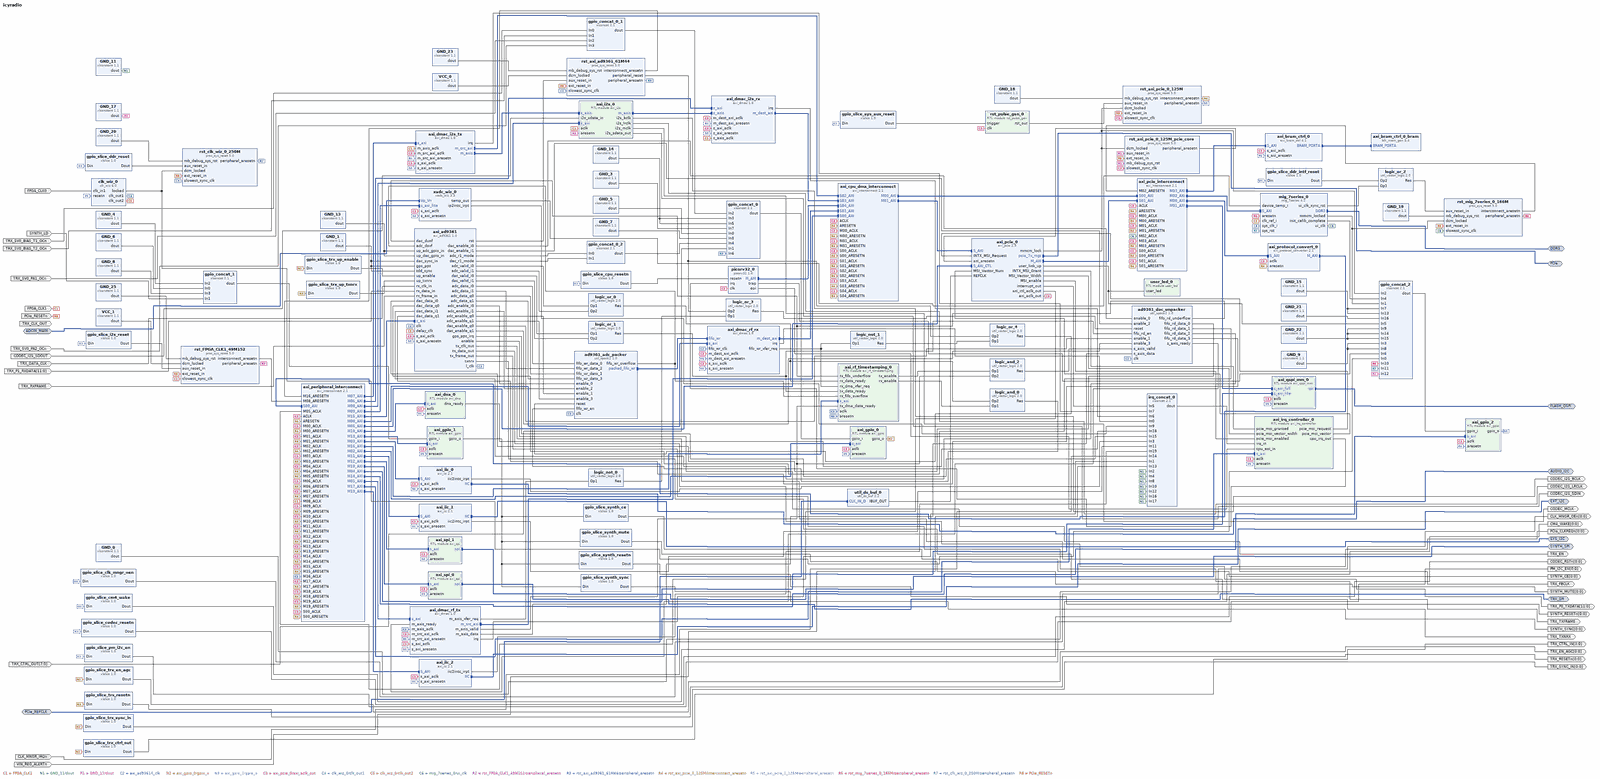
[diagram p0: block diagram of the top level, whole]
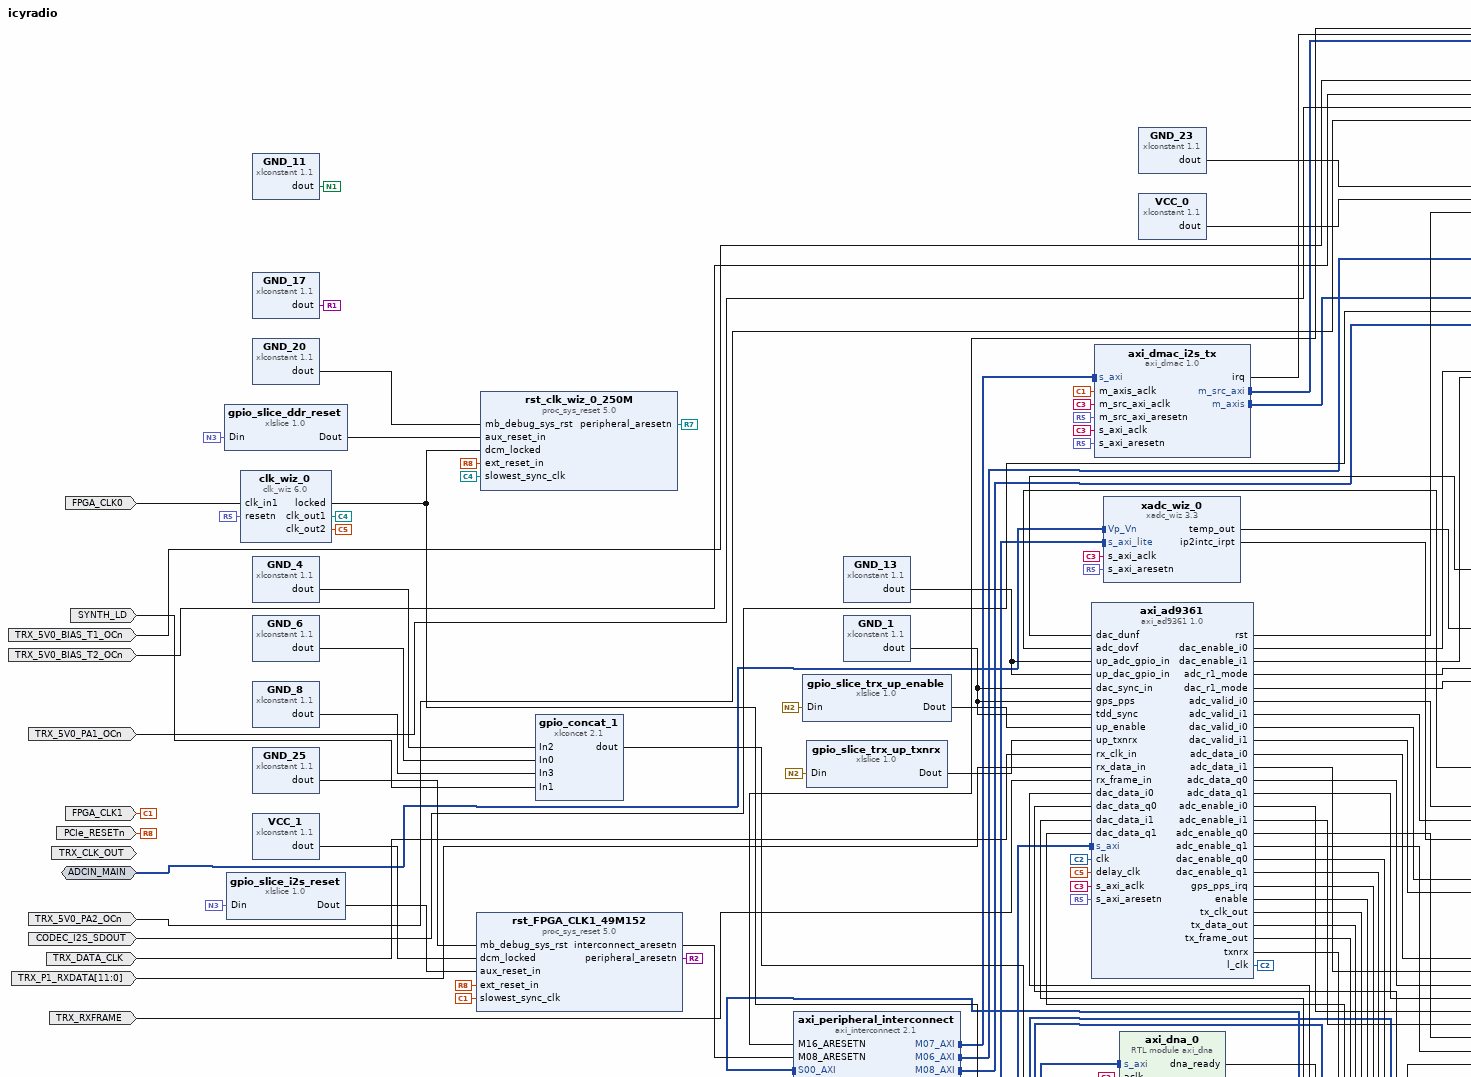
[diagram p1: block diagram of the top level, upper left part]
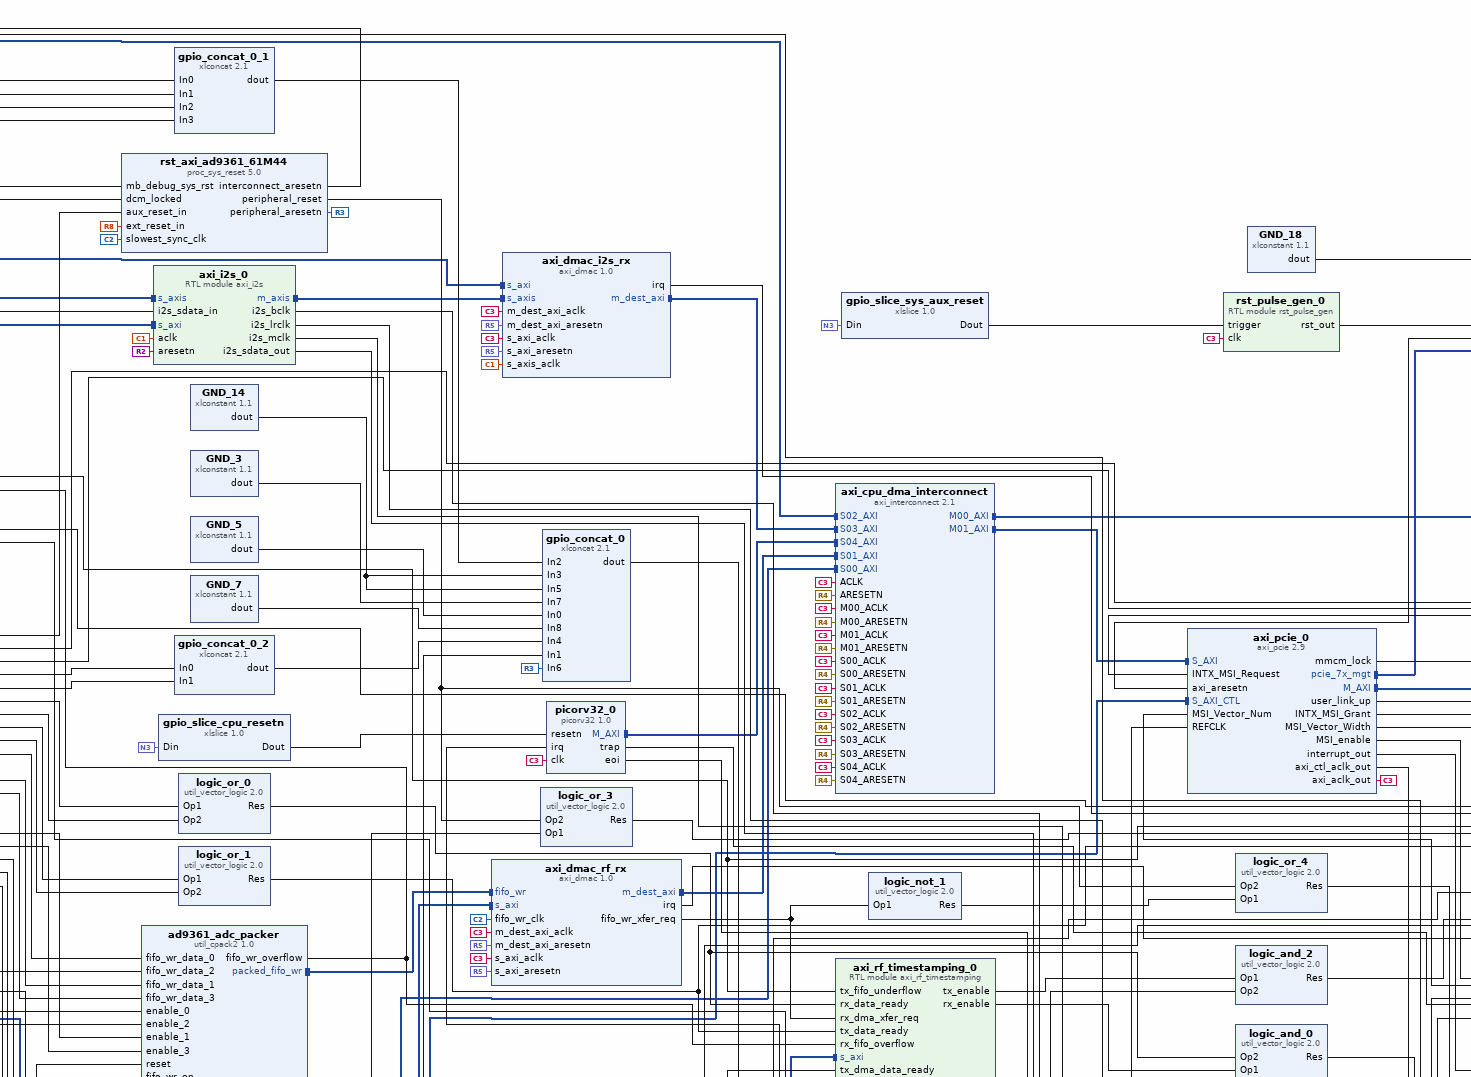
[diagram p2: block diagram of the top level, upper centre part]
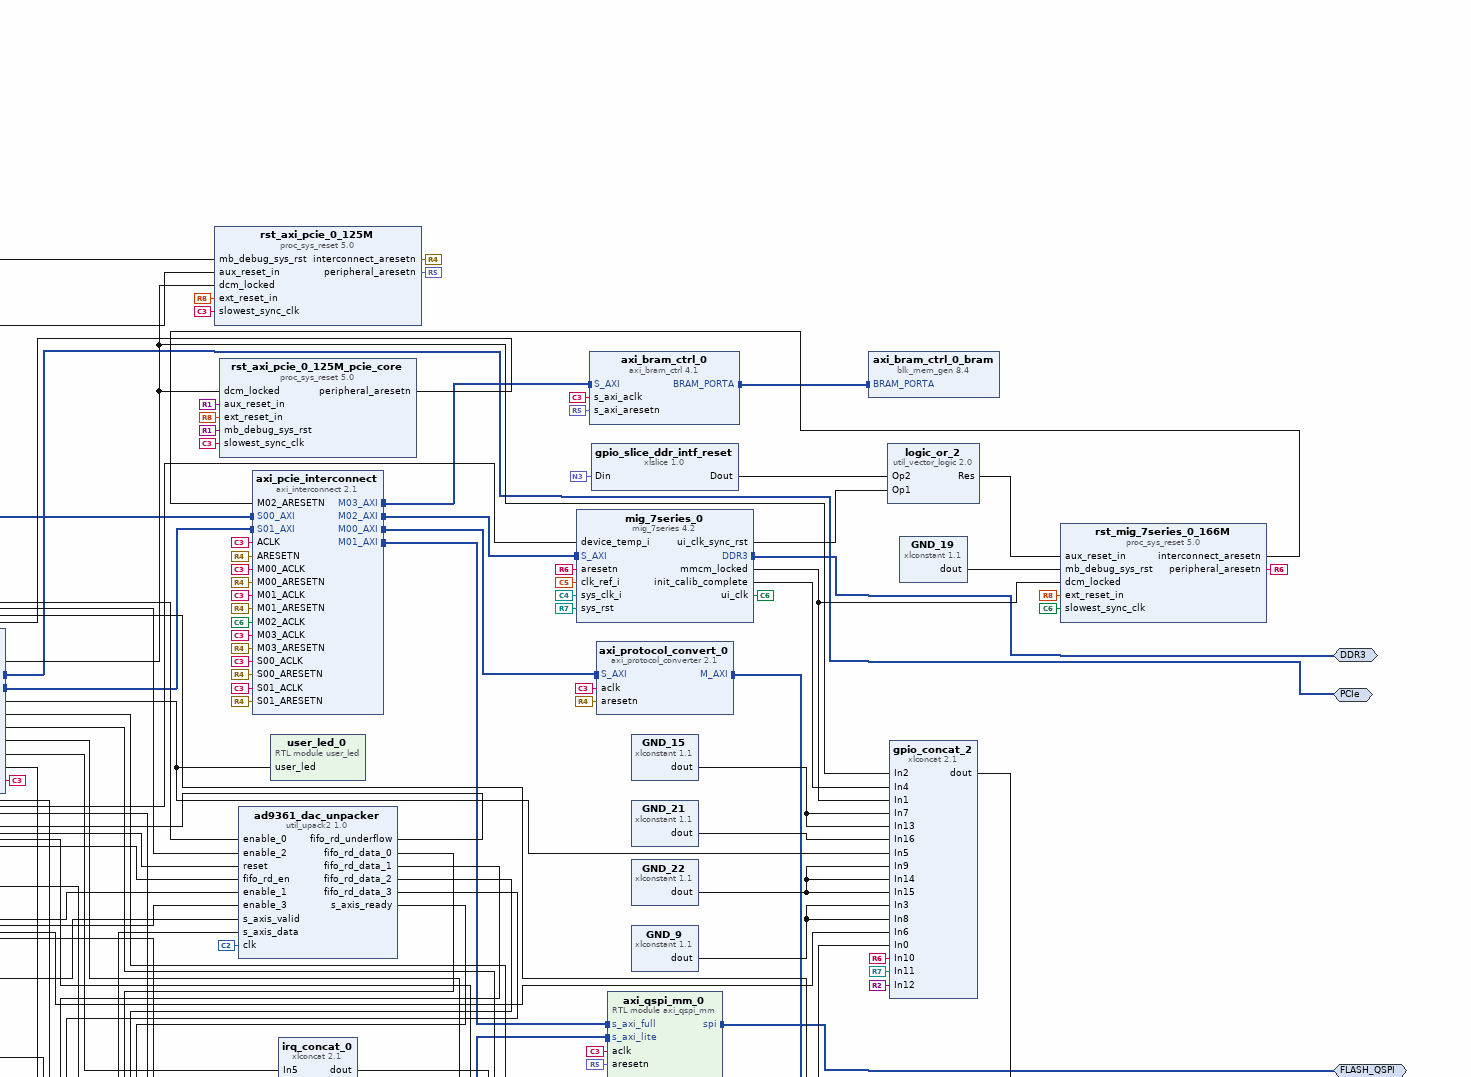
[diagram p3: block diagram of the top level, upper right part]
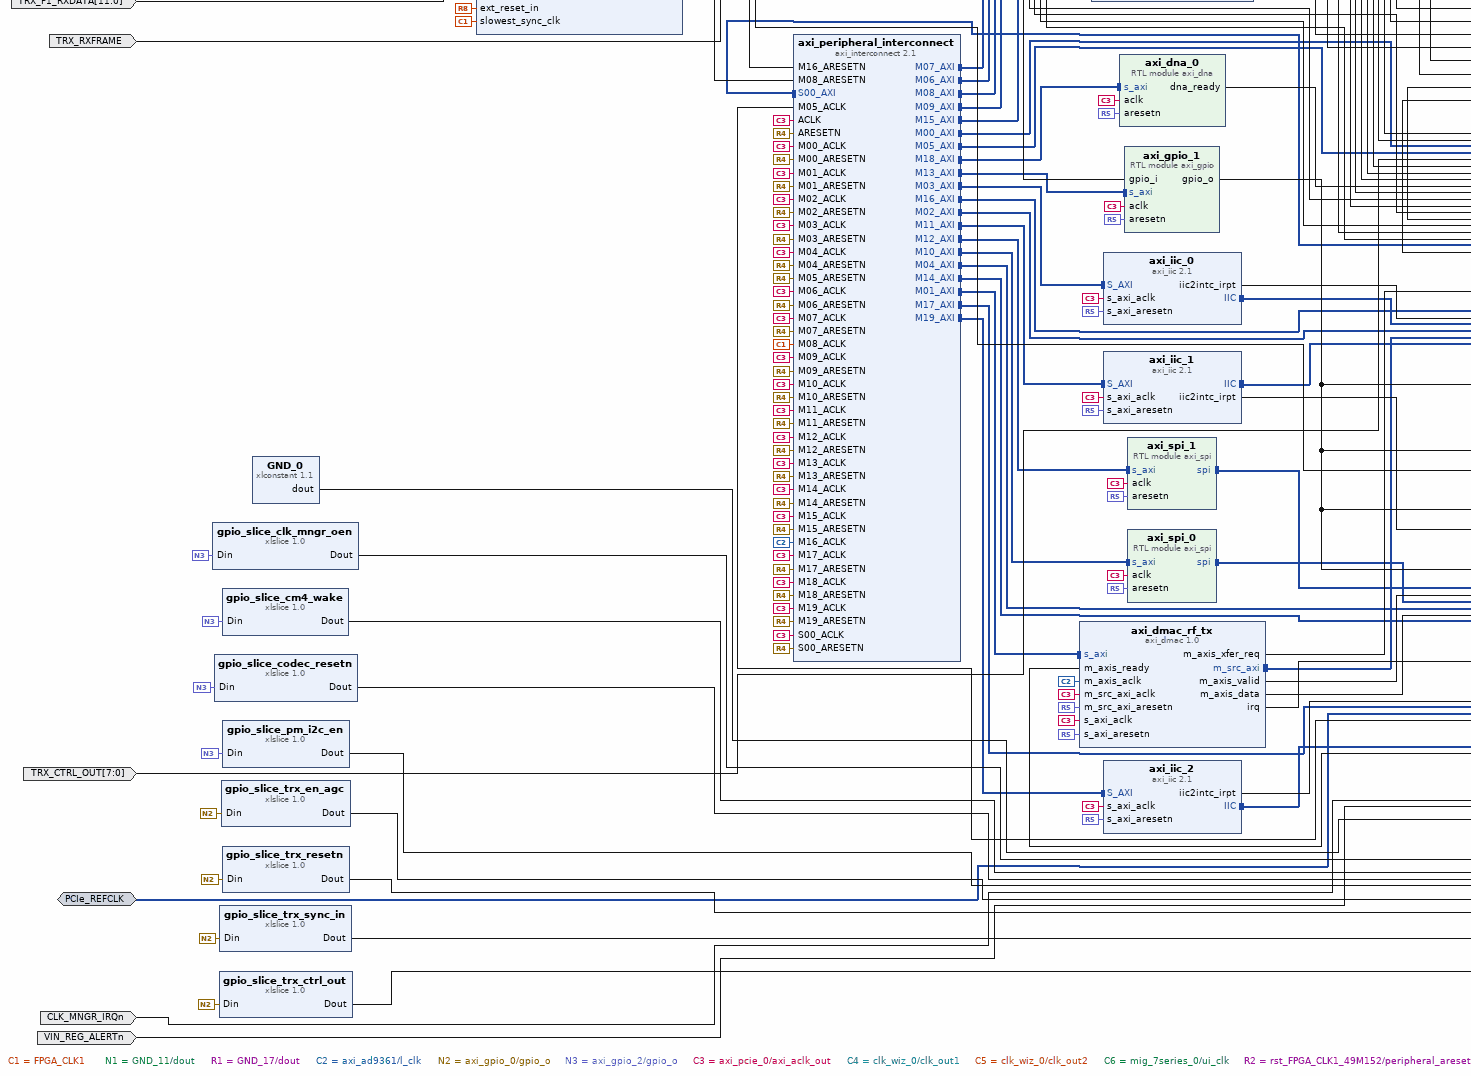
[diagram p4: block diagram of the top level, lower left part]
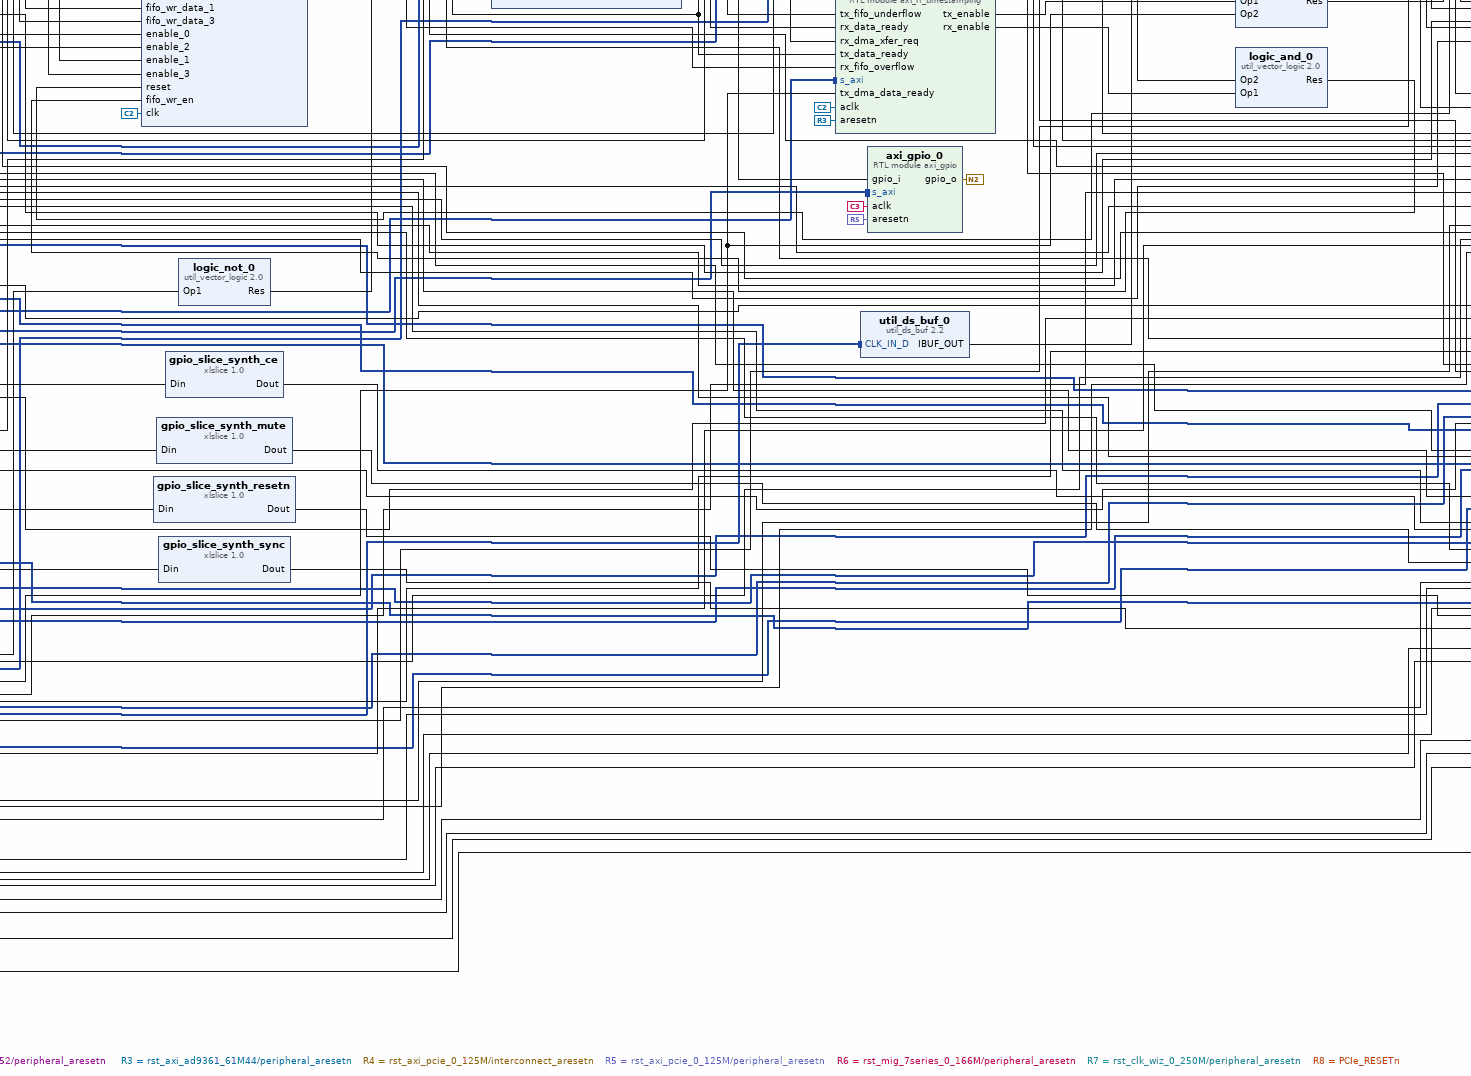
[diagram p5: block diagram of the top level, lower centre part]
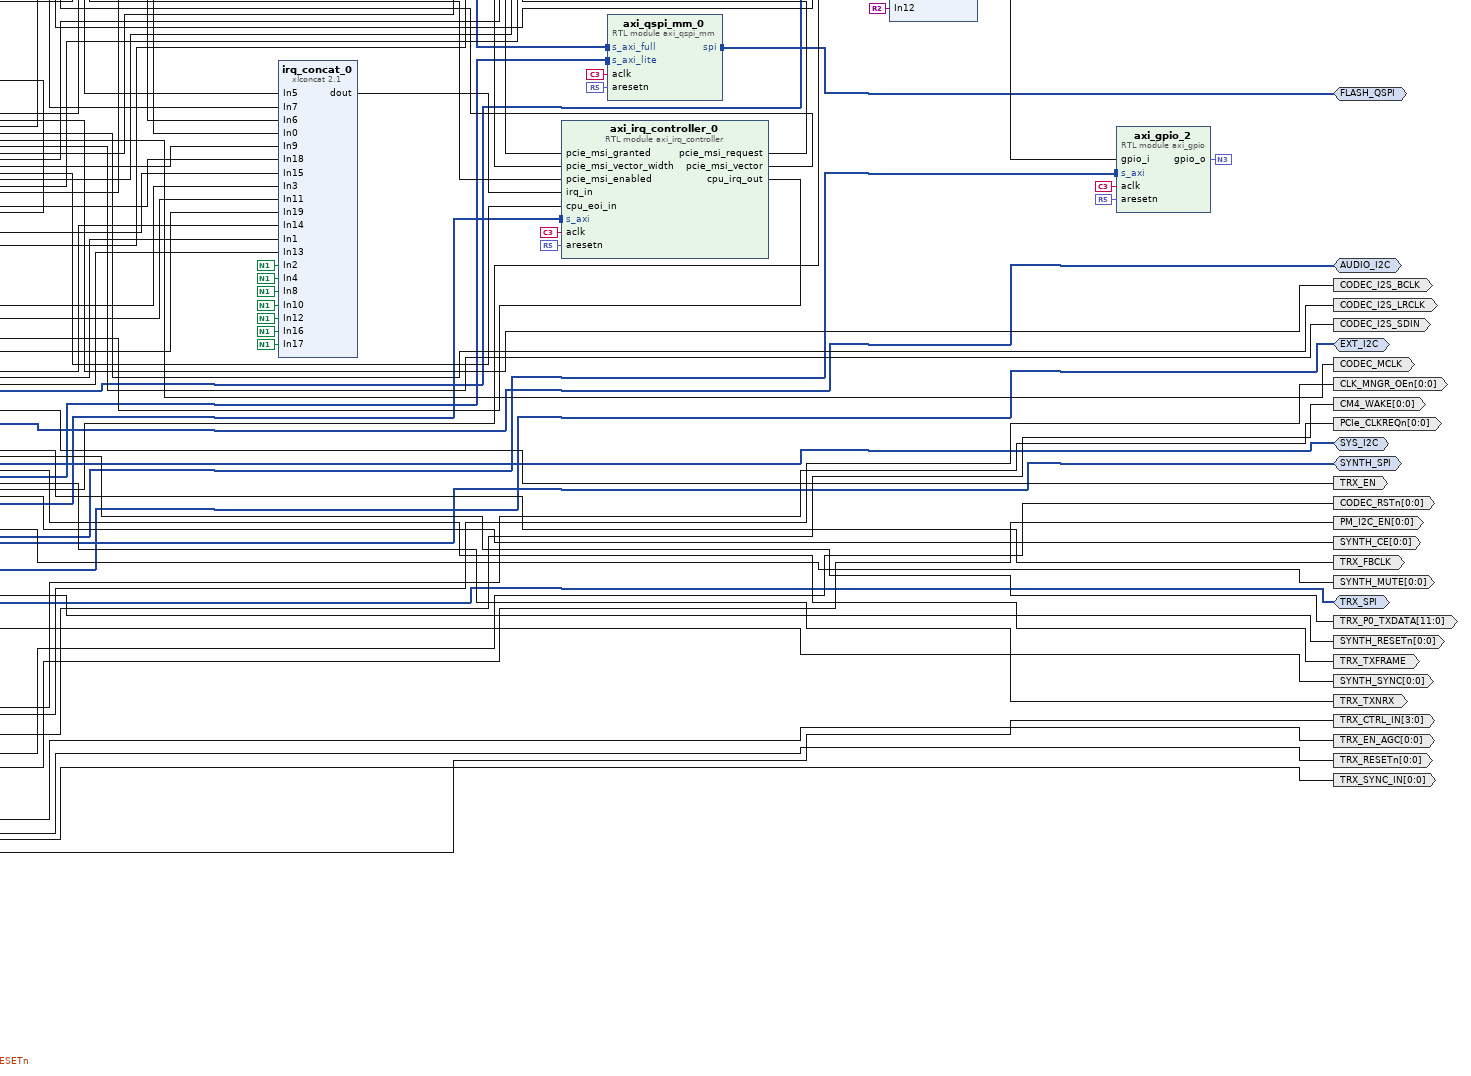
[diagram p6: block diagram of the top level, lower right part]
# Vivado block design icyradio, xc7a100tfgg484-2, Vivado 2021.1
create_bd_design icyradio

create_bd_intf_port -mode Slave -vlnv xilinx.com:interface:diff_clock_rtl:1.0 PCIe_REFCLK
create_bd_intf_port -mode Master -vlnv xilinx.com:interface:pcie_7x_mgt_rtl:1.0 PCIe
create_bd_intf_port -mode Master -vlnv xilinx.com:interface:iic_rtl:1.0 AUDIO_I2C
create_bd_intf_port -mode Master -vlnv xilinx.com:interface:spi_rtl:1.0 FLASH_QSPI
create_bd_intf_port -mode Master -vlnv xilinx.com:interface:ddrx_rtl:1.0 DDR3
create_bd_intf_port -mode Slave -vlnv xilinx.com:interface:diff_analog_io_rtl:1.0 ADCIN_MAIN
create_bd_intf_port -mode Master -vlnv xilinx.com:interface:spi_rtl:1.0 TRX_SPI
create_bd_intf_port -mode Master -vlnv xilinx.com:interface:iic_rtl:1.0 SYS_I2C
create_bd_intf_port -mode Master -vlnv xilinx.com:interface:iic_rtl:1.0 EXT_I2C
create_bd_intf_port -mode Master -vlnv xilinx.com:interface:spi_rtl:1.0 SYNTH_SPI
create_bd_port -dir I -from 11 -to 0 -type data TRX_P1_RXDATA
create_bd_port -dir O -from 11 -to 0 -type data TRX_P0_TXDATA
create_bd_port -dir I -type clk TRX_DATA_CLK
set_property -dict {CONFIG.FREQ_HZ 61440000} [get_bd_ports TRX_DATA_CLK]
create_bd_port -dir O -type clk TRX_FBCLK
create_bd_port -dir O TRX_TXFRAME
create_bd_port -dir I TRX_RXFRAME
create_bd_port -dir O TRX_EN
create_bd_port -dir O TRX_TXNRX
create_bd_port -dir I -type rst PCIe_RESETn
create_bd_port -dir I -type clk FPGA_CLK1
set_property -dict {CONFIG.FREQ_HZ 49152000 CONFIG.PHASE 0.0} [get_bd_ports FPGA_CLK1]
create_bd_port -dir I -type clk TRX_CLK_OUT
set_property -dict {CONFIG.FREQ_HZ 100000000} [get_bd_ports TRX_CLK_OUT]
create_bd_port -dir I -from 7 -to 0 TRX_CTRL_OUT
create_bd_port -dir O -from 3 -to 0 TRX_CTRL_IN
create_bd_port -dir O -from 0 -to 0 TRX_EN_AGC
create_bd_port -dir O -from 0 -to 0 -type rst CODEC_RSTn
create_bd_port -dir O -from 0 -to 0 PCIe_CLKREQn
create_bd_port -dir O -from 0 -to 0 -type rst TRX_RESETn
create_bd_port -dir O -from 0 -to 0 TRX_SYNC_IN
create_bd_port -dir O -from 0 -to 0 SYNTH_RESETn
create_bd_port -dir I TRX_5V0_PA1_OCn
create_bd_port -dir I TRX_5V0_PA2_OCn
create_bd_port -dir I TRX_5V0_BIAS_T1_OCn
create_bd_port -dir I TRX_5V0_BIAS_T2_OCn
create_bd_port -dir I SYNTH_LD
create_bd_port -dir O -from 0 -to 0 SYNTH_MUTE
create_bd_port -dir O -from 0 -to 0 SYNTH_SYNC
create_bd_port -dir O -from 0 -to 0 SYNTH_CE
create_bd_port -dir O -from 0 -to 0 CLK_MNGR_OEn
create_bd_port -dir O -from 0 -to 0 PM_I2C_EN
create_bd_port -dir I CLK_MNGR_IRQn
create_bd_port -dir O -from 0 -to 0 CM4_WAKE
create_bd_port -dir I VIN_REG_ALERTn
create_bd_port -dir O CODEC_I2S_BCLK
create_bd_port -dir O CODEC_I2S_LRCLK
create_bd_port -dir O CODEC_I2S_SDIN
create_bd_port -dir I CODEC_I2S_SDOUT
create_bd_port -dir O CODEC_MCLK
create_bd_port -dir I -type clk FPGA_CLK0
set_property -dict {CONFIG.FREQ_HZ 50000000} [get_bd_ports FPGA_CLK0]

create_bd_cell -type ip -vlnv xilinx.com:ip:blk_mem_gen:8.4 axi_bram_ctrl_0_bram
set_property -dict [list \
  CONFIG.EN_SAFETY_CKT true \
  CONFIG.Enable_32bit_Address true \
  CONFIG.Register_PortA_Output_of_Memory_Primitives false \
  CONFIG.Use_RSTA_Pin true \
  CONFIG.use_bram_block BRAM_Controller \
] [get_bd_cells axi_bram_ctrl_0_bram]
create_bd_cell -type ip -vlnv xilinx.com:ip:util_vector_logic:2.0 logic_and_0
set_property -dict {CONFIG.C_OPERATION and CONFIG.C_SIZE 1} [get_bd_cells logic_and_0]
create_bd_cell -type ip -vlnv xilinx.com:ip:mig_7series:4.2 mig_7series_0
set_property -dict [list \
  CONFIG.BOARD_MIG_PARAM Custom \
  CONFIG.RESET_BOARD_INTERFACE Custom \
  CONFIG.XML_INPUT_FILE mig_a.prj \
] [get_bd_cells mig_7series_0]
create_bd_cell -type ip -vlnv xilinx.com:ip:proc_sys_reset:5.0 rst_mig_7series_0_166M
set_property -dict {CONFIG.C_AUX_RESET_HIGH 1 CONFIG.C_AUX_RST_WIDTH 4} [get_bd_cells rst_mig_7series_0_166M]
create_bd_cell -type ip -vlnv xilinx.com:ip:proc_sys_reset:5.0 rst_axi_pcie_0_125M
set_property -dict {CONFIG.C_AUX_RESET_HIGH 1 CONFIG.C_AUX_RST_WIDTH 4} [get_bd_cells rst_axi_pcie_0_125M]
create_bd_cell -type ip -vlnv analog.com:user:util_upack2:1.0 ad9361_dac_unpacker
create_bd_cell -type ip -vlnv xilinx.com:ip:util_vector_logic:2.0 logic_or_1
set_property -dict {CONFIG.C_OPERATION or CONFIG.C_SIZE 1} [get_bd_cells logic_or_1]
create_bd_cell -type ip -vlnv xilinx.com:ip:util_vector_logic:2.0 logic_or_0
set_property -dict {CONFIG.C_OPERATION or CONFIG.C_SIZE 1} [get_bd_cells logic_or_0]
create_bd_cell -type ip -vlnv xilinx.com:ip:xadc_wiz:3.3 xadc_wiz_0
set_property -dict [list \
  CONFIG.ADC_CONVERSION_RATE 1000 \
  CONFIG.ADC_OFFSET_AND_GAIN_CALIBRATION true \
  CONFIG.AVERAGE_ENABLE_TEMPERATURE true \
  CONFIG.AVERAGE_ENABLE_VBRAM true \
  CONFIG.AVERAGE_ENABLE_VCCAUX true \
  CONFIG.AVERAGE_ENABLE_VCCINT true \
  CONFIG.AVERAGE_ENABLE_VP_VN false \
  CONFIG.CHANNEL_AVERAGING 16 \
  CONFIG.CHANNEL_ENABLE_CALIBRATION false \
  CONFIG.CHANNEL_ENABLE_TEMPERATURE true \
  CONFIG.CHANNEL_ENABLE_VAUXP0_VAUXN0 false \
  CONFIG.CHANNEL_ENABLE_VAUXP10_VAUXN10 false \
  CONFIG.CHANNEL_ENABLE_VAUXP11_VAUXN11 false \
  CONFIG.CHANNEL_ENABLE_VAUXP12_VAUXN12 false \
  CONFIG.CHANNEL_ENABLE_VAUXP13_VAUXN13 false \
  CONFIG.CHANNEL_ENABLE_VAUXP14_VAUXN14 false \
  CONFIG.CHANNEL_ENABLE_VAUXP15_VAUXN15 false \
  CONFIG.CHANNEL_ENABLE_VAUXP1_VAUXN1 false \
  CONFIG.CHANNEL_ENABLE_VAUXP2_VAUXN2 false \
  CONFIG.CHANNEL_ENABLE_VAUXP3_VAUXN3 false \
  CONFIG.CHANNEL_ENABLE_VAUXP4_VAUXN4 false \
  CONFIG.CHANNEL_ENABLE_VAUXP5_VAUXN5 false \
  CONFIG.CHANNEL_ENABLE_VAUXP6_VAUXN6 false \
  CONFIG.CHANNEL_ENABLE_VAUXP7_VAUXN7 false \
  CONFIG.CHANNEL_ENABLE_VAUXP8_VAUXN8 false \
  CONFIG.CHANNEL_ENABLE_VAUXP9_VAUXN9 false \
  CONFIG.CHANNEL_ENABLE_VBRAM true \
  CONFIG.CHANNEL_ENABLE_VCCAUX true \
  CONFIG.CHANNEL_ENABLE_VCCINT true \
  CONFIG.CHANNEL_ENABLE_VP_VN false \
  CONFIG.CHANNEL_ENABLE_VREFN false \
  CONFIG.CHANNEL_ENABLE_VREFP false \
  CONFIG.DCLK_FREQUENCY 125 \
  CONFIG.ENABLE_EXTERNAL_MUX false \
  CONFIG.ENABLE_RESET false \
  CONFIG.ENABLE_TEMP_BUS true \
  CONFIG.ENABLE_VBRAM_ALARM false \
  CONFIG.EXTERNAL_MUX_CHANNEL VP_VN \
  CONFIG.INTERFACE_SELECTION Enable_AXI \
  CONFIG.OT_ALARM false \
  CONFIG.SENSOR_OFFSET_AND_GAIN_CALIBRATION true \
  CONFIG.SEQUENCER_MODE Continuous \
  CONFIG.SINGLE_CHANNEL_SELECTION TEMPERATURE \
  CONFIG.TEMPERATURE_ALARM_OT_RESET 100.0 \
  CONFIG.USER_TEMP_ALARM false \
  CONFIG.VCCAUX_ALARM false \
  CONFIG.VCCINT_ALARM false \
  CONFIG.XADC_STARUP_SELECTION channel_sequencer \
] [get_bd_cells xadc_wiz_0]
create_bd_cell -type ip -vlnv xilinx.com:ip:xlconcat:2.1 irq_concat_0
set_property -dict {CONFIG.NUM_PORTS 20 CONFIG.dout_width 20} [get_bd_cells irq_concat_0]
create_bd_cell -type ip -vlnv xilinx.com:ip:xlconstant:1.1 GND_0
set_property -dict {CONFIG.CONST_VAL 0} [get_bd_cells GND_0]
create_bd_cell -type ip -vlnv analog.com:user:axi_ad9361:1.0 axi_ad9361
set_property -dict [list \
  CONFIG.ADC_USERPORTS_DISABLE 1 \
  CONFIG.CMOS_OR_LVDS_N 1 \
  CONFIG.DAC_IODELAY_ENABLE 0 \
  CONFIG.DAC_USERPORTS_DISABLE 1 \
  CONFIG.DELAY_REFCLK_FREQUENCY 200 \
  CONFIG.DEV_PACKAGE 10 \
  CONFIG.FPGA_FAMILY 1 \
  CONFIG.FPGA_TECHNOLOGY 1 \
  CONFIG.SPEED_GRADE 20 \
  CONFIG.TDD_DISABLE 1 \
] [get_bd_cells axi_ad9361]
create_bd_cell -type ip -vlnv xilinx.com:ip:axi_bram_ctrl:4.1 axi_bram_ctrl_0
set_property -dict [list \
  CONFIG.DATA_WIDTH 64 \
  CONFIG.PROTOCOL AXI4 \
  CONFIG.SINGLE_PORT_BRAM 1 \
  CONFIG.USE_ECC 0 \
] [get_bd_cells axi_bram_ctrl_0]
create_bd_cell -type ip -vlnv xilinx.com:ip:axi_iic:2.1 axi_iic_0
create_bd_cell -type ip -vlnv xilinx.com:ip:axi_pcie:2.9 axi_pcie_0
set_property -dict [list \
  CONFIG.AXIBAR2PCIEBAR_0 0x00000000 \
  CONFIG.AXIBAR2PCIEBAR_1 0x00000000 \
  CONFIG.AXIBAR2PCIEBAR_2 0x00000000 \
  CONFIG.AXIBAR_AS_0 true \
  CONFIG.AXIBAR_AS_1 true \
  CONFIG.AXIBAR_AS_2 true \
  CONFIG.AXIBAR_NUM 3 \
  CONFIG.BAR0_SCALE Megabytes \
  CONFIG.BAR0_SIZE 2 \
  CONFIG.BAR1_ENABLED true \
  CONFIG.BAR1_SCALE Megabytes \
  CONFIG.BAR1_SIZE 512 \
  CONFIG.BAR1_TYPE Memory \
  CONFIG.BAR2_ENABLED true \
  CONFIG.BAR2_SCALE Megabytes \
  CONFIG.BAR2_SIZE 32 \
  CONFIG.BAR2_TYPE Memory \
  CONFIG.BAR_64BIT false \
  CONFIG.BASE_CLASS_MENU Wireless_controller \
  CONFIG.CLASS_CODE 0x0D1000 \
  CONFIG.DEVICE_ID 0x7021 \
  CONFIG.MAX_LINK_SPEED 5.0_GT/s \
  CONFIG.M_AXI_DATA_WIDTH 64 \
  CONFIG.NO_OF_LANES X1 \
  CONFIG.NUM_MSI_REQ 5 \
  CONFIG.PCIEBAR2AXIBAR_0 0x40000000 \
  CONFIG.PCIEBAR2AXIBAR_1 0x20000000 \
  CONFIG.PCIEBAR2AXIBAR_2 0x00000000 \
  CONFIG.SUB_CLASS_INTERFACE_MENU RF_controller \
  CONFIG.S_AXI_DATA_WIDTH 64 \
  CONFIG.S_AXI_SUPPORTS_NARROW_BURST true \
] [get_bd_cells axi_pcie_0]
create_bd_cell -type ip -vlnv xilinx.com:ip:axi_protocol_converter:2.1 axi_protocol_convert_0
set_property -dict {CONFIG.MI_PROTOCOL AXI4LITE CONFIG.SI_PROTOCOL AXI4} [get_bd_cells axi_protocol_convert_0]
create_bd_cell -type ip -vlnv xilinx.com:ip:util_ds_buf:2.2 util_ds_buf_0
set_property -dict {CONFIG.C_BUF_TYPE IBUFDSGTE} [get_bd_cells util_ds_buf_0]
create_bd_cell -type ip -vlnv xilinx.com:ip:util_vector_logic:2.0 logic_and_2
set_property -dict {CONFIG.C_OPERATION and CONFIG.C_SIZE 1} [get_bd_cells logic_and_2]
create_bd_cell -type ip -vlnv clifford.at:user:picorv32:1.0 picorv32_0
set_property -dict [list \
  CONFIG.COMPRESSED_ISA true \
  CONFIG.ENABLE_DIV true \
  CONFIG.ENABLE_FAST_MUL true \
  CONFIG.ENABLE_IRQ true \
  CONFIG.ENABLE_MUL false \
  CONFIG.ENABLE_PCPI false \
  CONFIG.ENABLE_TRACE false \
  CONFIG.LATCHED_IRQ 0xFFFFFFFF \
  CONFIG.PROGADDR_IRQ 0x01000010 \
  CONFIG.PROGADDR_RESET 0x01000000 \
  CONFIG.STACKADDR 0x01020000 \
  CONFIG.TWO_CYCLE_COMPARE false \
] [get_bd_cells picorv32_0]
create_bd_cell -type ip -vlnv xilinx.com:ip:axi_iic:2.1 axi_iic_1
set_property -dict {CONFIG.C_DEFAULT_VALUE 0x00 CONFIG.C_GPO_WIDTH 1} [get_bd_cells axi_iic_1]
create_bd_cell -type ip -vlnv xilinx.com:ip:clk_wiz:6.0 clk_wiz_0
set_property -dict [list \
  CONFIG.CLKIN1_JITTER_PS 0.3422 \
  CONFIG.CLKIN1_UI_JITTER 0.3422 \
  CONFIG.CLKIN2_JITTER_PS 100.000 \
  CONFIG.CLKIN2_UI_JITTER 100.000 \
  CONFIG.CLKOUT1_DRIVES BUFG \
  CONFIG.CLKOUT1_JITTER 136.987 \
  CONFIG.CLKOUT1_REQUESTED_OUT_FREQ 250 \
  CONFIG.CLKOUT2_DRIVES BUFG \
  CONFIG.CLKOUT2_JITTER 142.107 \
  CONFIG.CLKOUT2_PHASE_ERROR 164.985 \
  CONFIG.CLKOUT2_REQUESTED_OUT_FREQ 200 \
  CONFIG.CLKOUT2_USED true \
  CONFIG.CLKOUT3_DRIVES BUFG \
  CONFIG.CLKOUT3_JITTER 285.743 \
  CONFIG.CLKOUT3_PHASE_ERROR 164.985 \
  CONFIG.CLKOUT3_REQUESTED_OUT_FREQ 10 \
  CONFIG.CLKOUT3_USED false \
  CONFIG.CLKOUT4_DRIVES BUFG \
  CONFIG.CLKOUT5_DRIVES BUFG \
  CONFIG.CLKOUT6_DRIVES BUFG \
  CONFIG.CLKOUT7_DRIVES BUFG \
  CONFIG.FEEDBACK_SOURCE FDBK_AUTO \
  CONFIG.JITTER_OPTIONS PS \
  CONFIG.JITTER_SEL Min_O_Jitter \
  CONFIG.MMCM_BANDWIDTH HIGH \
  CONFIG.MMCM_CLKOUT0_DIVIDE_F 4.000 \
  CONFIG.MMCM_CLKOUT1_DIVIDE 5 \
  CONFIG.MMCM_CLKOUT2_DIVIDE 1 \
  CONFIG.MMCM_REF_JITTER1 0.000 \
  CONFIG.MMCM_REF_JITTER2 0.010 \
  CONFIG.NUM_OUT_CLKS 2 \
  CONFIG.RESET_PORT resetn \
  CONFIG.RESET_TYPE ACTIVE_LOW \
  CONFIG.SECONDARY_SOURCE Single_ended_clock_capable_pin \
  CONFIG.USE_PHASE_ALIGNMENT false \
  CONFIG.USE_POWER_DOWN false \
  CONFIG.USE_SAFE_CLOCK_STARTUP false \
] [get_bd_cells clk_wiz_0]
create_bd_cell -type ip -vlnv xilinx.com:ip:xlslice:1.0 gpio_slice_trx_ctrl_out
set_property -dict {CONFIG.DIN_FROM 3 CONFIG.DOUT_WIDTH 4} [get_bd_cells gpio_slice_trx_ctrl_out]
create_bd_cell -type ip -vlnv xilinx.com:ip:xlslice:1.0 gpio_slice_trx_sync_in
set_property -dict {CONFIG.DIN_FROM 5 CONFIG.DIN_TO 5 CONFIG.DOUT_WIDTH 1} [get_bd_cells gpio_slice_trx_sync_in]
create_bd_cell -type ip -vlnv xilinx.com:ip:xlslice:1.0 gpio_slice_trx_en_agc
set_property -dict {CONFIG.DIN_FROM 4 CONFIG.DIN_TO 4 CONFIG.DOUT_WIDTH 1} [get_bd_cells gpio_slice_trx_en_agc]
create_bd_cell -type ip -vlnv xilinx.com:ip:xlconcat:2.1 gpio_concat_0
set_property -dict [list \
  CONFIG.IN0_WIDTH 8 \
  CONFIG.IN1_WIDTH 8 \
  CONFIG.IN2_WIDTH 4 \
  CONFIG.IN3_WIDTH 2 \
  CONFIG.IN4_WIDTH 2 \
  CONFIG.IN5_WIDTH 2 \
  CONFIG.IN6_WIDTH 1 \
  CONFIG.IN7_WIDTH 4 \
  CONFIG.IN8_WIDTH 1 \
  CONFIG.NUM_PORTS 9 \
  CONFIG.dout_width 32 \
] [get_bd_cells gpio_concat_0]
create_bd_cell -type ip -vlnv xilinx.com:ip:xlconstant:1.1 GND_3
set_property -dict {CONFIG.CONST_VAL 0 CONFIG.CONST_WIDTH 4} [get_bd_cells GND_3]
create_bd_cell -type ip -vlnv xilinx.com:ip:xlslice:1.0 gpio_slice_trx_up_txnrx
set_property -dict {CONFIG.DIN_FROM 7 CONFIG.DIN_TO 7 CONFIG.DOUT_WIDTH 1} [get_bd_cells gpio_slice_trx_up_txnrx]
create_bd_cell -type ip -vlnv xilinx.com:ip:xlslice:1.0 gpio_slice_trx_up_enable
set_property -dict {CONFIG.DIN_FROM 6 CONFIG.DIN_TO 6 CONFIG.DOUT_WIDTH 1} [get_bd_cells gpio_slice_trx_up_enable]
create_bd_cell -type ip -vlnv xilinx.com:ip:xlconcat:2.1 gpio_concat_0_1
set_property -dict [list \
  CONFIG.IN0_WIDTH 1 \
  CONFIG.IN1_WIDTH 1 \
  CONFIG.IN2_WIDTH 1 \
  CONFIG.IN3_WIDTH 1 \
  CONFIG.NUM_PORTS 4 \
  CONFIG.dout_width 4 \
] [get_bd_cells gpio_concat_0_1]
create_bd_cell -type ip -vlnv xilinx.com:ip:xlconcat:2.1 gpio_concat_1
set_property -dict [list \
  CONFIG.IN0_WIDTH 8 \
  CONFIG.IN1_WIDTH 1 \
  CONFIG.IN2_WIDTH 22 \
  CONFIG.IN3_WIDTH 1 \
  CONFIG.NUM_PORTS 4 \
  CONFIG.dout_width 32 \
] [get_bd_cells gpio_concat_1]
create_bd_cell -type ip -vlnv xilinx.com:ip:xlconstant:1.1 GND_4
set_property -dict {CONFIG.CONST_VAL 0 CONFIG.CONST_WIDTH 22} [get_bd_cells GND_4]
create_bd_cell -type ip -vlnv xilinx.com:ip:xlslice:1.0 gpio_slice_synth_ce
set_property -dict {CONFIG.DIN_FROM 0 CONFIG.DIN_TO 0 CONFIG.DOUT_WIDTH 1} [get_bd_cells gpio_slice_synth_ce]
create_bd_cell -type ip -vlnv xilinx.com:ip:xlslice:1.0 gpio_slice_synth_mute
set_property -dict {CONFIG.DIN_FROM 1 CONFIG.DIN_TO 1 CONFIG.DOUT_WIDTH 1} [get_bd_cells gpio_slice_synth_mute]
create_bd_cell -type ip -vlnv xilinx.com:ip:xlslice:1.0 gpio_slice_synth_sync
set_property -dict {CONFIG.DIN_FROM 2 CONFIG.DIN_TO 2 CONFIG.DOUT_WIDTH 1} [get_bd_cells gpio_slice_synth_sync]
create_bd_cell -type ip -vlnv xilinx.com:ip:xlslice:1.0 gpio_slice_pm_i2c_en
set_property -dict [list \
  CONFIG.DIN_FROM 10 \
  CONFIG.DIN_TO 10 \
  CONFIG.DIN_WIDTH 32 \
  CONFIG.DOUT_WIDTH 1 \
] [get_bd_cells gpio_slice_pm_i2c_en]
create_bd_cell -type ip -vlnv xilinx.com:ip:xlslice:1.0 gpio_slice_clk_mngr_oen
set_property -dict [list \
  CONFIG.DIN_FROM 11 \
  CONFIG.DIN_TO 11 \
  CONFIG.DIN_WIDTH 32 \
  CONFIG.DOUT_WIDTH 1 \
] [get_bd_cells gpio_slice_clk_mngr_oen]
create_bd_cell -type ip -vlnv xilinx.com:ip:xlconstant:1.1 GND_5
set_property -dict {CONFIG.CONST_VAL 0 CONFIG.CONST_WIDTH 8} [get_bd_cells GND_5]
create_bd_cell -type ip -vlnv xilinx.com:ip:xlconstant:1.1 GND_6
set_property -dict {CONFIG.CONST_VAL 0 CONFIG.CONST_WIDTH 8} [get_bd_cells GND_6]
create_bd_cell -type ip -vlnv analog.com:user:util_cpack2:1.0 ad9361_adc_packer
create_bd_cell -type ip -vlnv xilinx.com:ip:xlslice:1.0 gpio_slice_trx_resetn
set_property -dict {CONFIG.DIN_FROM 31 CONFIG.DIN_TO 31 CONFIG.DOUT_WIDTH 1} [get_bd_cells gpio_slice_trx_resetn]
create_bd_cell -type ip -vlnv xilinx.com:ip:xlconstant:1.1 GND_7
set_property -dict {CONFIG.CONST_VAL 0 CONFIG.CONST_WIDTH 1} [get_bd_cells GND_7]
create_bd_cell -type ip -vlnv xilinx.com:ip:xlslice:1.0 gpio_slice_synth_resetn
set_property -dict {CONFIG.DIN_FROM 31 CONFIG.DIN_TO 31 CONFIG.DOUT_WIDTH 1} [get_bd_cells gpio_slice_synth_resetn]
create_bd_cell -type ip -vlnv xilinx.com:ip:xlconstant:1.1 GND_8
set_property -dict {CONFIG.CONST_VAL 0 CONFIG.CONST_WIDTH 1} [get_bd_cells GND_8]
create_bd_cell -type ip -vlnv xilinx.com:ip:proc_sys_reset:5.0 rst_clk_wiz_0_250M
set_property -dict {CONFIG.C_AUX_RESET_HIGH 1 CONFIG.C_AUX_RST_WIDTH 4} [get_bd_cells rst_clk_wiz_0_250M]
create_bd_cell -type ip -vlnv xilinx.com:ip:xlslice:1.0 gpio_slice_sys_aux_reset
set_property -dict {CONFIG.DIN_FROM 31 CONFIG.DIN_TO 31 CONFIG.DOUT_WIDTH 1} [get_bd_cells gpio_slice_sys_aux_reset]
create_bd_cell -type ip -vlnv xilinx.com:ip:xlslice:1.0 gpio_slice_cpu_resetn
set_property -dict {CONFIG.DIN_FROM 30 CONFIG.DIN_TO 30 CONFIG.DOUT_WIDTH 1} [get_bd_cells gpio_slice_cpu_resetn]
create_bd_cell -type ip -vlnv xilinx.com:ip:xlconcat:2.1 gpio_concat_2
set_property -dict [list \
  CONFIG.IN0_WIDTH 1 \
  CONFIG.IN10_WIDTH 1 \
  CONFIG.IN11_WIDTH 1 \
  CONFIG.IN12_WIDTH 1 \
  CONFIG.IN13_WIDTH 5 \
  CONFIG.IN14_WIDTH 3 \
  CONFIG.IN15_WIDTH 3 \
  CONFIG.IN16_WIDTH 2 \
  CONFIG.IN1_WIDTH 1 \
  CONFIG.IN2_WIDTH 1 \
  CONFIG.IN3_WIDTH 1 \
  CONFIG.IN4_WIDTH 1 \
  CONFIG.IN5_WIDTH 1 \
  CONFIG.IN6_WIDTH 1 \
  CONFIG.IN7_WIDTH 5 \
  CONFIG.IN8_WIDTH 1 \
  CONFIG.IN9_WIDTH 3 \
  CONFIG.NUM_PORTS 17 \
  CONFIG.dout_width 32 \
] [get_bd_cells gpio_concat_2]
create_bd_cell -type ip -vlnv xilinx.com:ip:xlconstant:1.1 GND_9
set_property -dict {CONFIG.CONST_VAL 0 CONFIG.CONST_WIDTH 1} [get_bd_cells GND_9]
create_bd_cell -type ip -vlnv xilinx.com:ip:xlslice:1.0 gpio_slice_cm4_wake
set_property -dict {CONFIG.DIN_FROM 8 CONFIG.DIN_TO 8 CONFIG.DOUT_WIDTH 1} [get_bd_cells gpio_slice_cm4_wake]
create_bd_cell -type ip -vlnv xilinx.com:ip:xlconstant:1.1 GND_1
set_property -dict {CONFIG.CONST_VAL 0} [get_bd_cells GND_1]
create_bd_cell -type ip -vlnv xilinx.com:ip:xlconstant:1.1 GND_11
set_property -dict {CONFIG.CONST_VAL 0} [get_bd_cells GND_11]
create_bd_cell -type ip -vlnv xilinx.com:ip:xlconstant:1.1 GND_13
set_property -dict {CONFIG.CONST_VAL 0 CONFIG.CONST_WIDTH 32} [get_bd_cells GND_13]
create_bd_cell -type ip -vlnv xilinx.com:ip:xlconstant:1.1 GND_14
set_property -dict {CONFIG.CONST_VAL 0 CONFIG.CONST_WIDTH 2} [get_bd_cells GND_14]
create_bd_cell -type ip -vlnv xilinx.com:ip:xlconcat:2.1 gpio_concat_0_2
set_property -dict [list \
  CONFIG.IN0_WIDTH 1 \
  CONFIG.IN1_WIDTH 1 \
  CONFIG.IN2_WIDTH 1 \
  CONFIG.IN3_WIDTH 1 \
  CONFIG.NUM_PORTS 2 \
  CONFIG.dout_width 2 \
] [get_bd_cells gpio_concat_0_2]
create_bd_cell -type ip -vlnv xilinx.com:ip:xlconstant:1.1 GND_15
set_property -dict {CONFIG.CONST_VAL 0 CONFIG.CONST_WIDTH 5} [get_bd_cells GND_15]
create_bd_cell -type ip -vlnv xilinx.com:ip:proc_sys_reset:5.0 rst_axi_pcie_0_125M_pcie_core
set_property -dict {CONFIG.C_AUX_RESET_HIGH 1 CONFIG.C_AUX_RST_WIDTH 4} [get_bd_cells rst_axi_pcie_0_125M_pcie_core]
create_bd_cell -type ip -vlnv xilinx.com:ip:xlconstant:1.1 GND_17
set_property -dict {CONFIG.CONST_VAL 0} [get_bd_cells GND_17]
create_bd_cell -type ip -vlnv xilinx.com:ip:xlconstant:1.1 GND_18
set_property -dict {CONFIG.CONST_VAL 0} [get_bd_cells GND_18]
create_bd_cell -type ip -vlnv xilinx.com:ip:xlconstant:1.1 GND_19
set_property -dict {CONFIG.CONST_VAL 0} [get_bd_cells GND_19]
create_bd_cell -type ip -vlnv xilinx.com:ip:xlconstant:1.1 GND_20
set_property -dict {CONFIG.CONST_VAL 0} [get_bd_cells GND_20]
create_bd_cell -type module -reference rst_pulse_gen rst_pulse_gen_0
create_bd_cell -type ip -vlnv xilinx.com:ip:axi_interconnect:2.1 axi_peripheral_interconnect
set_property -dict {CONFIG.NUM_MI 20 CONFIG.STRATEGY 1} [get_bd_cells axi_peripheral_interconnect]
create_bd_cell -type ip -vlnv xilinx.com:ip:axi_interconnect:2.1 axi_cpu_dma_interconnect
set_property -dict [list \
  CONFIG.NUM_MI 2 \
  CONFIG.NUM_SI 5 \
  CONFIG.S00_HAS_DATA_FIFO 2 \
  CONFIG.S01_HAS_DATA_FIFO 2 \
  CONFIG.S02_HAS_DATA_FIFO 2 \
  CONFIG.S03_HAS_DATA_FIFO 2 \
  CONFIG.S04_HAS_DATA_FIFO 2 \
  CONFIG.STRATEGY 2 \
] [get_bd_cells axi_cpu_dma_interconnect]
create_bd_cell -type ip -vlnv xilinx.com:ip:xlslice:1.0 gpio_slice_ddr_reset
set_property -dict {CONFIG.DIN_FROM 25 CONFIG.DIN_TO 25 CONFIG.DOUT_WIDTH 1} [get_bd_cells gpio_slice_ddr_reset]
create_bd_cell -type ip -vlnv xilinx.com:ip:xlconstant:1.1 GND_21
set_property -dict {CONFIG.CONST_VAL 0 CONFIG.CONST_WIDTH 2} [get_bd_cells GND_21]
create_bd_cell -type ip -vlnv xilinx.com:ip:xlconstant:1.1 GND_22
set_property -dict {CONFIG.CONST_VAL 0 CONFIG.CONST_WIDTH 3} [get_bd_cells GND_22]
create_bd_cell -type ip -vlnv xilinx.com:ip:xlslice:1.0 gpio_slice_ddr_intf_reset
set_property -dict {CONFIG.DIN_FROM 24 CONFIG.DIN_TO 24 CONFIG.DOUT_WIDTH 1} [get_bd_cells gpio_slice_ddr_intf_reset]
create_bd_cell -type ip -vlnv xilinx.com:ip:util_vector_logic:2.0 logic_or_2
set_property -dict {CONFIG.C_OPERATION or CONFIG.C_SIZE 1} [get_bd_cells logic_or_2]
create_bd_cell -type ip -vlnv xilinx.com:ip:proc_sys_reset:5.0 rst_axi_ad9361_61M44
set_property -dict {CONFIG.C_AUX_RESET_HIGH 1 CONFIG.C_AUX_RST_WIDTH 4} [get_bd_cells rst_axi_ad9361_61M44]
create_bd_cell -type ip -vlnv xilinx.com:ip:xlconstant:1.1 VCC_0
set_property -dict {CONFIG.CONST_VAL 1} [get_bd_cells VCC_0]
create_bd_cell -type ip -vlnv xilinx.com:ip:xlconstant:1.1 GND_23
set_property -dict {CONFIG.CONST_VAL 0} [get_bd_cells GND_23]
create_bd_cell -type ip -vlnv xilinx.com:ip:util_vector_logic:2.0 logic_or_3
set_property -dict {CONFIG.C_OPERATION or CONFIG.C_SIZE 1} [get_bd_cells logic_or_3]
create_bd_cell -type ip -vlnv xilinx.com:ip:util_vector_logic:2.0 logic_not_0
set_property -dict {CONFIG.C_OPERATION not CONFIG.C_SIZE 1} [get_bd_cells logic_not_0]
create_bd_cell -type ip -vlnv xilinx.com:ip:util_vector_logic:2.0 logic_or_4
set_property -dict {CONFIG.C_OPERATION or CONFIG.C_SIZE 1} [get_bd_cells logic_or_4]
create_bd_cell -type ip -vlnv xilinx.com:ip:util_vector_logic:2.0 logic_not_1
set_property -dict {CONFIG.C_OPERATION not CONFIG.C_SIZE 1} [get_bd_cells logic_not_1]
create_bd_cell -type ip -vlnv xilinx.com:ip:proc_sys_reset:5.0 rst_FPGA_CLK1_49M152
set_property -dict {CONFIG.C_AUX_RESET_HIGH 1 CONFIG.C_AUX_RST_WIDTH 4} [get_bd_cells rst_FPGA_CLK1_49M152]
create_bd_cell -type ip -vlnv xilinx.com:ip:xlconstant:1.1 GND_25
set_property -dict {CONFIG.CONST_VAL 0} [get_bd_cells GND_25]
create_bd_cell -type ip -vlnv xilinx.com:ip:xlconstant:1.1 VCC_1
set_property -dict {CONFIG.CONST_VAL 1} [get_bd_cells VCC_1]
create_bd_cell -type ip -vlnv xilinx.com:ip:xlslice:1.0 gpio_slice_i2s_reset
set_property -dict {CONFIG.DIN_FROM 26 CONFIG.DIN_TO 26 CONFIG.DOUT_WIDTH 1} [get_bd_cells gpio_slice_i2s_reset]
create_bd_cell -type module -reference user_led user_led_0
create_bd_cell -type ip -vlnv analog.com:user:axi_dmac:1.0 axi_dmac_i2s_rx
set_property -dict [list \
  CONFIG.ALLOW_ASYM_MEM 1 \
  CONFIG.AXI_SLICE_DEST false \
  CONFIG.CYCLIC false \
  CONFIG.DMA_DATA_WIDTH_DEST 64 \
  CONFIG.DMA_DATA_WIDTH_SRC 32 \
  CONFIG.DMA_LENGTH_WIDTH 24 \
  CONFIG.DMA_TYPE_DEST 0 \
  CONFIG.DMA_TYPE_SRC 1 \
  CONFIG.ID 2 \
] [get_bd_cells axi_dmac_i2s_rx]
create_bd_cell -type ip -vlnv analog.com:user:axi_dmac:1.0 axi_dmac_rf_rx
set_property -dict [list \
  CONFIG.ALLOW_ASYM_MEM 1 \
  CONFIG.CYCLIC false \
  CONFIG.DMA_LENGTH_WIDTH 24 \
  CONFIG.SYNC_TRANSFER_START true \
] [get_bd_cells axi_dmac_rf_rx]
create_bd_cell -type ip -vlnv analog.com:user:axi_dmac:1.0 axi_dmac_i2s_tx
set_property -dict [list \
  CONFIG.ALLOW_ASYM_MEM 1 \
  CONFIG.AXI_SLICE_DEST false \
  CONFIG.CYCLIC false \
  CONFIG.DMA_DATA_WIDTH_DEST 32 \
  CONFIG.DMA_LENGTH_WIDTH 24 \
  CONFIG.DMA_TYPE_DEST 1 \
  CONFIG.DMA_TYPE_SRC 0 \
  CONFIG.ID 3 \
] [get_bd_cells axi_dmac_i2s_tx]
create_bd_cell -type ip -vlnv analog.com:user:axi_dmac:1.0 axi_dmac_rf_tx
set_property -dict [list \
  CONFIG.ALLOW_ASYM_MEM 1 \
  CONFIG.CYCLIC false \
  CONFIG.DMA_LENGTH_WIDTH 24 \
  CONFIG.DMA_TYPE_DEST 1 \
  CONFIG.DMA_TYPE_SRC 0 \
  CONFIG.ID 1 \
] [get_bd_cells axi_dmac_rf_tx]
create_bd_cell -type ip -vlnv xilinx.com:ip:xlslice:1.0 gpio_slice_codec_resetn
set_property -dict [list \
  CONFIG.DIN_FROM 9 \
  CONFIG.DIN_TO 9 \
  CONFIG.DIN_WIDTH 32 \
  CONFIG.DOUT_WIDTH 1 \
] [get_bd_cells gpio_slice_codec_resetn]
create_bd_cell -type ip -vlnv xilinx.com:ip:axi_iic:2.1 axi_iic_2
set_property -dict {CONFIG.C_DEFAULT_VALUE 0x00 CONFIG.C_GPO_WIDTH 1} [get_bd_cells axi_iic_2]
create_bd_cell -type module -reference axi_dna axi_dna_0
create_bd_cell -type module -reference axi_i2s axi_i2s_0
create_bd_cell -type module -reference axi_rf_timestamping axi_rf_timestamping_0
create_bd_cell -type module -reference axi_irq_controller axi_irq_controller_0
set_property -dict [list \
  CONFIG.NUM_IRQS 20 \
  CONFIG.PCIE_MSI_REQ_FIFO_DEPTH_W 5 \
  CONFIG.PCIE_MSI_VEC_SIZE 5 \
] [get_bd_cells axi_irq_controller_0]
create_bd_cell -type module -reference axi_gpio axi_gpio_0
set_property -dict {CONFIG.GPIO_OUT_DEFAULT 0x80000000 CONFIG.GPIO_TRI_DEFAULT 0x04CFFF00} [get_bd_cells axi_gpio_0]
create_bd_cell -type module -reference axi_gpio axi_gpio_1
set_property -dict {CONFIG.GPIO_OUT_DEFAULT 0x80000002 CONFIG.GPIO_TRI_DEFAULT 0x00000100} [get_bd_cells axi_gpio_1]
create_bd_cell -type module -reference axi_gpio axi_gpio_2
set_property -dict {CONFIG.GPIO_OUT_DEFAULT 0x07000800 CONFIG.GPIO_TRI_DEFAULT 0x00070077} [get_bd_cells axi_gpio_2]
create_bd_cell -type ip -vlnv xilinx.com:ip:axi_interconnect:2.1 axi_pcie_interconnect
set_property -dict [list \
  CONFIG.NUM_MI 4 \
  CONFIG.NUM_SI 2 \
  CONFIG.S00_HAS_DATA_FIFO 2 \
  CONFIG.S01_HAS_DATA_FIFO 2 \
  CONFIG.STRATEGY 2 \
] [get_bd_cells axi_pcie_interconnect]
create_bd_cell -type module -reference axi_qspi_mm axi_qspi_mm_0
set_property -dict {CONFIG.SCK_DIV_SZ 4} [get_bd_cells axi_qspi_mm_0]
create_bd_cell -type module -reference axi_spi axi_spi_1
set_property -dict {CONFIG.SCK_DIV_SZ 8} [get_bd_cells axi_spi_1]
create_bd_cell -type module -reference axi_spi axi_spi_0

# ---- connections ----

connect_bd_intf_net [get_bd_intf_ports PCIe_REFCLK] [get_bd_intf_pins util_ds_buf_0/CLK_IN_D]
connect_bd_intf_net -intf_net Vp_Vn_0_1 [get_bd_intf_ports ADCIN_MAIN] [get_bd_intf_pins xadc_wiz_0/Vp_Vn]
connect_bd_intf_net [get_bd_intf_pins axi_bram_ctrl_0_bram/BRAM_PORTA] [get_bd_intf_pins axi_bram_ctrl_0/BRAM_PORTA]
connect_bd_intf_net [get_bd_intf_pins axi_cpu_dma_interconnect/M00_AXI] [get_bd_intf_pins axi_pcie_interconnect/S00_AXI]
connect_bd_intf_net [get_bd_intf_pins axi_dmac_i2s_rx/m_dest_axi] [get_bd_intf_pins axi_cpu_dma_interconnect/S03_AXI]
connect_bd_intf_net [get_bd_intf_pins axi_i2s_0/s_axis] [get_bd_intf_pins axi_dmac_i2s_tx/m_axis]
connect_bd_intf_net [get_bd_intf_pins axi_dmac_i2s_tx/m_src_axi] [get_bd_intf_pins axi_cpu_dma_interconnect/S02_AXI]
connect_bd_intf_net [get_bd_intf_pins axi_dmac_rf_rx/m_dest_axi] [get_bd_intf_pins axi_cpu_dma_interconnect/S01_AXI]
connect_bd_intf_net [get_bd_intf_pins axi_dmac_rf_tx/m_src_axi] [get_bd_intf_pins axi_cpu_dma_interconnect/S00_AXI]
connect_bd_intf_net [get_bd_intf_pins axi_dmac_i2s_rx/s_axis] [get_bd_intf_pins axi_i2s_0/m_axis]
connect_bd_intf_net [get_bd_intf_ports AUDIO_I2C] [get_bd_intf_pins axi_iic_0/IIC]
connect_bd_intf_net [get_bd_intf_ports SYS_I2C] [get_bd_intf_pins axi_iic_1/IIC]
connect_bd_intf_net [get_bd_intf_ports EXT_I2C] [get_bd_intf_pins axi_iic_2/IIC]
connect_bd_intf_net -intf_net axi_interconnect_0_M00_AXI [get_bd_intf_pins axi_dmac_rf_rx/s_axi] [get_bd_intf_pins axi_peripheral_interconnect/M00_AXI]
connect_bd_intf_net -intf_net axi_interconnect_0_M00_AXI1 [get_bd_intf_pins axi_protocol_convert_0/S_AXI] [get_bd_intf_pins axi_pcie_interconnect/M00_AXI]
connect_bd_intf_net -intf_net axi_interconnect_0_M01_AXI [get_bd_intf_pins axi_dmac_rf_tx/s_axi] [get_bd_intf_pins axi_peripheral_interconnect/M01_AXI]
connect_bd_intf_net -intf_net axi_interconnect_0_M01_AXI1 [get_bd_intf_pins axi_qspi_mm_0/s_axi_full] [get_bd_intf_pins axi_pcie_interconnect/M01_AXI]
connect_bd_intf_net -intf_net axi_interconnect_0_M01_AXI2 [get_bd_intf_pins axi_cpu_dma_interconnect/M01_AXI] [get_bd_intf_pins axi_pcie_0/S_AXI]
connect_bd_intf_net -intf_net axi_interconnect_0_M02_AXI [get_bd_intf_pins axi_pcie_interconnect/M02_AXI] [get_bd_intf_pins mig_7series_0/S_AXI]
connect_bd_intf_net -intf_net axi_interconnect_0_M03_AXI [get_bd_intf_pins axi_iic_0/S_AXI] [get_bd_intf_pins axi_peripheral_interconnect/M03_AXI]
connect_bd_intf_net -intf_net axi_interconnect_0_M03_AXI1 [get_bd_intf_pins axi_pcie_interconnect/M03_AXI] [get_bd_intf_pins axi_bram_ctrl_0/S_AXI]
connect_bd_intf_net -intf_net axi_interconnect_0_M05_AXI [get_bd_intf_pins axi_pcie_0/S_AXI_CTL] [get_bd_intf_pins axi_peripheral_interconnect/M05_AXI]
connect_bd_intf_net -intf_net axi_interconnect_0_M06_AXI [get_bd_intf_pins axi_dmac_i2s_rx/s_axi] [get_bd_intf_pins axi_peripheral_interconnect/M06_AXI]
connect_bd_intf_net -intf_net axi_interconnect_0_M07_AXI [get_bd_intf_pins axi_peripheral_interconnect/M07_AXI] [get_bd_intf_pins axi_dmac_i2s_tx/s_axi]
connect_bd_intf_net -intf_net axi_interconnect_0_M09_AXI [get_bd_intf_pins xadc_wiz_0/s_axi_lite] [get_bd_intf_pins axi_peripheral_interconnect/M09_AXI]
connect_bd_intf_net -intf_net axi_interconnect_0_M11_AXI [get_bd_intf_pins axi_iic_1/S_AXI] [get_bd_intf_pins axi_peripheral_interconnect/M11_AXI]
connect_bd_intf_net -intf_net axi_interconnect_0_M15_AXI [get_bd_intf_pins axi_ad9361/s_axi] [get_bd_intf_pins axi_peripheral_interconnect/M15_AXI]
connect_bd_intf_net [get_bd_intf_pins axi_pcie_0/M_AXI] [get_bd_intf_pins axi_pcie_interconnect/S01_AXI]
connect_bd_intf_net [get_bd_intf_ports PCIe] [get_bd_intf_pins axi_pcie_0/pcie_7x_mgt]
connect_bd_intf_net [get_bd_intf_pins axi_peripheral_interconnect/M02_AXI] [get_bd_intf_pins axi_gpio_0/s_axi]
connect_bd_intf_net [get_bd_intf_pins axi_qspi_mm_0/s_axi_lite] [get_bd_intf_pins axi_peripheral_interconnect/M04_AXI]
connect_bd_intf_net [get_bd_intf_pins axi_i2s_0/s_axi] [get_bd_intf_pins axi_peripheral_interconnect/M08_AXI]
connect_bd_intf_net [get_bd_intf_pins axi_spi_0/s_axi] [get_bd_intf_pins axi_peripheral_interconnect/M10_AXI]
connect_bd_intf_net [get_bd_intf_pins axi_spi_1/s_axi] [get_bd_intf_pins axi_peripheral_interconnect/M12_AXI]
connect_bd_intf_net [get_bd_intf_pins axi_peripheral_interconnect/M13_AXI] [get_bd_intf_pins axi_gpio_1/s_axi]
connect_bd_intf_net [get_bd_intf_pins axi_gpio_2/s_axi] [get_bd_intf_pins axi_peripheral_interconnect/M14_AXI]
connect_bd_intf_net [get_bd_intf_pins axi_peripheral_interconnect/M16_AXI] [get_bd_intf_pins axi_rf_timestamping_0/s_axi]
connect_bd_intf_net [get_bd_intf_pins axi_irq_controller_0/s_axi] [get_bd_intf_pins axi_peripheral_interconnect/M17_AXI]
connect_bd_intf_net [get_bd_intf_pins axi_dna_0/s_axi] [get_bd_intf_pins axi_peripheral_interconnect/M18_AXI]
connect_bd_intf_net [get_bd_intf_pins axi_iic_2/S_AXI] [get_bd_intf_pins axi_peripheral_interconnect/M19_AXI]
connect_bd_intf_net [get_bd_intf_pins axi_protocol_convert_0/M_AXI] [get_bd_intf_pins axi_peripheral_interconnect/S00_AXI]
connect_bd_intf_net [get_bd_intf_ports FLASH_QSPI] [get_bd_intf_pins axi_qspi_mm_0/spi]
connect_bd_intf_net [get_bd_intf_ports TRX_SPI] [get_bd_intf_pins axi_spi_0/spi]
connect_bd_intf_net [get_bd_intf_ports SYNTH_SPI] [get_bd_intf_pins axi_spi_1/spi]
connect_bd_intf_net [get_bd_intf_ports DDR3] [get_bd_intf_pins mig_7series_0/DDR3]
connect_bd_intf_net [get_bd_intf_pins picorv32_0/M_AXI] [get_bd_intf_pins axi_cpu_dma_interconnect/S04_AXI]
connect_bd_intf_net -intf_net util_cpack2_0_packed_fifo_wr [get_bd_intf_pins ad9361_adc_packer/packed_fifo_wr] [get_bd_intf_pins axi_dmac_rf_rx/fifo_wr]
connect_bd_net [get_bd_ports CLK_MNGR_IRQn] [get_bd_pins irq_concat_0/In14]
connect_bd_net -net FPGA_CLK0_1 [get_bd_ports FPGA_CLK0] [get_bd_pins clk_wiz_0/clk_in1]
connect_bd_net -net FPGA_CLK1_1 [get_bd_ports FPGA_CLK1] \
  [get_bd_pins rst_FPGA_CLK1_49M152/slowest_sync_clk] [get_bd_pins axi_peripheral_interconnect/M08_ACLK] \
  [get_bd_pins axi_dmac_i2s_rx/s_axis_aclk] [get_bd_pins axi_dmac_i2s_tx/m_axis_aclk] [get_bd_pins axi_i2s_0/aclk]
connect_bd_net [get_bd_pins GND_0/dout] [get_bd_ports PCIe_CLKREQn]
connect_bd_net [get_bd_pins GND_11/dout] \
  [get_bd_pins irq_concat_0/In8] [get_bd_pins irq_concat_0/In2] [get_bd_pins irq_concat_0/In16] \
  [get_bd_pins irq_concat_0/In17] [get_bd_pins irq_concat_0/In12] [get_bd_pins irq_concat_0/In10] \
  [get_bd_pins irq_concat_0/In4]
connect_bd_net [get_bd_pins GND_13/dout] [get_bd_pins axi_ad9361/up_dac_gpio_in] [get_bd_pins axi_ad9361/up_adc_gpio_in]
connect_bd_net [get_bd_pins GND_14/dout] [get_bd_pins gpio_concat_0/In3] [get_bd_pins gpio_concat_0/In5]
connect_bd_net [get_bd_pins GND_15/dout] [get_bd_pins gpio_concat_2/In7] [get_bd_pins gpio_concat_2/In13]
connect_bd_net [get_bd_pins GND_17/dout] \
  [get_bd_pins rst_axi_pcie_0_125M_pcie_core/mb_debug_sys_rst] [get_bd_pins rst_axi_pcie_0_125M_pcie_core/aux_reset_in]
connect_bd_net [get_bd_pins GND_18/dout] [get_bd_pins rst_axi_pcie_0_125M/mb_debug_sys_rst]
connect_bd_net [get_bd_pins GND_19/dout] [get_bd_pins rst_mig_7series_0_166M/mb_debug_sys_rst]
connect_bd_net [get_bd_pins GND_1/dout] [get_bd_pins axi_ad9361/tdd_sync] [get_bd_pins axi_ad9361/dac_sync_in] [get_bd_pins axi_ad9361/gps_pps]
connect_bd_net [get_bd_pins GND_20/dout] [get_bd_pins rst_clk_wiz_0_250M/mb_debug_sys_rst]
connect_bd_net [get_bd_pins GND_21/dout] [get_bd_pins gpio_concat_2/In16]
connect_bd_net [get_bd_pins GND_22/dout] [get_bd_pins gpio_concat_2/In9] [get_bd_pins gpio_concat_2/In14] [get_bd_pins gpio_concat_2/In15]
connect_bd_net [get_bd_pins GND_23/dout] [get_bd_pins rst_axi_ad9361_61M44/mb_debug_sys_rst]
connect_bd_net [get_bd_pins GND_25/dout] [get_bd_pins rst_FPGA_CLK1_49M152/mb_debug_sys_rst]
connect_bd_net [get_bd_pins GND_3/dout] [get_bd_pins gpio_concat_0/In7]
connect_bd_net [get_bd_pins GND_4/dout] [get_bd_pins gpio_concat_1/In2]
connect_bd_net [get_bd_pins GND_5/dout] [get_bd_pins gpio_concat_0/In0]
connect_bd_net [get_bd_pins GND_6/dout] [get_bd_pins gpio_concat_1/In0]
connect_bd_net [get_bd_pins GND_7/dout] [get_bd_pins gpio_concat_0/In8]
connect_bd_net [get_bd_pins GND_8/dout] [get_bd_pins gpio_concat_1/In3]
connect_bd_net [get_bd_pins GND_9/dout] [get_bd_pins gpio_concat_2/In3] [get_bd_pins gpio_concat_2/In8]
connect_bd_net -net M02_ARESETN_1 [get_bd_pins rst_mig_7series_0_166M/interconnect_aresetn] [get_bd_pins axi_pcie_interconnect/M02_ARESETN]
connect_bd_net -net M16_ARESETN_1 [get_bd_pins rst_axi_ad9361_61M44/interconnect_aresetn] [get_bd_pins axi_peripheral_interconnect/M16_ARESETN]
connect_bd_net -net RXCLK_1 [get_bd_ports TRX_DATA_CLK] [get_bd_pins axi_ad9361/rx_clk_in]
connect_bd_net -net RXDATA_1 [get_bd_ports TRX_P1_RXDATA] [get_bd_pins axi_ad9361/rx_data_in]
connect_bd_net -net RXFRAME_1 [get_bd_ports TRX_RXFRAME] [get_bd_pins axi_ad9361/rx_frame_in]
connect_bd_net [get_bd_ports SYNTH_LD] [get_bd_pins gpio_concat_1/In1]
connect_bd_net [get_bd_ports TRX_5V0_BIAS_T1_OCn] [get_bd_pins gpio_concat_0_1/In0]
connect_bd_net [get_bd_ports TRX_5V0_BIAS_T2_OCn] [get_bd_pins gpio_concat_0_1/In1]
connect_bd_net [get_bd_ports TRX_5V0_PA1_OCn] [get_bd_pins gpio_concat_0_1/In2]
connect_bd_net [get_bd_ports TRX_5V0_PA2_OCn] [get_bd_pins gpio_concat_0_1/In3]
connect_bd_net [get_bd_ports TRX_CTRL_OUT] [get_bd_pins gpio_concat_0/In1]
connect_bd_net [get_bd_pins VCC_0/dout] [get_bd_pins rst_axi_ad9361_61M44/dcm_locked]
connect_bd_net [get_bd_pins VCC_1/dout] [get_bd_pins rst_FPGA_CLK1_49M152/dcm_locked]
connect_bd_net [get_bd_ports VIN_REG_ALERTn] [get_bd_pins irq_concat_0/In13]
connect_bd_net [get_bd_pins ad9361_adc_packer/fifo_wr_overflow] [get_bd_pins axi_ad9361/adc_dovf] [get_bd_pins axi_rf_timestamping_0/rx_fifo_overflow]
connect_bd_net [get_bd_pins ad9361_dac_unpacker/fifo_rd_underflow] \
  [get_bd_pins axi_ad9361/dac_dunf] [get_bd_pins axi_rf_timestamping_0/tx_fifo_underflow]
connect_bd_net [get_bd_pins ad9361_dac_unpacker/s_axis_ready] [get_bd_pins axi_dmac_rf_tx/m_axis_ready]
connect_bd_net -net axi_ad9361_0_adc_data_i0 [get_bd_pins axi_ad9361/adc_data_i0] [get_bd_pins ad9361_adc_packer/fifo_wr_data_0]
connect_bd_net -net axi_ad9361_0_adc_data_i1 [get_bd_pins axi_ad9361/adc_data_i1] [get_bd_pins ad9361_adc_packer/fifo_wr_data_2]
connect_bd_net -net axi_ad9361_0_adc_data_q0 [get_bd_pins axi_ad9361/adc_data_q0] [get_bd_pins ad9361_adc_packer/fifo_wr_data_1]
connect_bd_net -net axi_ad9361_0_adc_data_q1 [get_bd_pins axi_ad9361/adc_data_q1] [get_bd_pins ad9361_adc_packer/fifo_wr_data_3]
connect_bd_net -net axi_ad9361_0_adc_enable_i0 [get_bd_pins axi_ad9361/adc_enable_i0] [get_bd_pins ad9361_adc_packer/enable_0]
connect_bd_net -net axi_ad9361_0_adc_enable_i1 [get_bd_pins axi_ad9361/adc_enable_i1] [get_bd_pins ad9361_adc_packer/enable_2]
connect_bd_net -net axi_ad9361_0_adc_enable_q0 [get_bd_pins axi_ad9361/adc_enable_q0] [get_bd_pins ad9361_adc_packer/enable_1]
connect_bd_net -net axi_ad9361_0_adc_enable_q1 [get_bd_pins axi_ad9361/adc_enable_q1] [get_bd_pins ad9361_adc_packer/enable_3]
connect_bd_net -net axi_ad9361_0_adc_valid_i0 [get_bd_pins axi_ad9361/adc_valid_i0] [get_bd_pins logic_or_0/Op1]
connect_bd_net -net axi_ad9361_0_adc_valid_i1 [get_bd_pins axi_ad9361/adc_valid_i1] [get_bd_pins logic_or_0/Op2]
connect_bd_net -net axi_ad9361_0_dac_enable_i0 [get_bd_pins axi_ad9361/dac_enable_i0] [get_bd_pins ad9361_dac_unpacker/enable_0]
connect_bd_net -net axi_ad9361_0_dac_enable_i1 [get_bd_pins axi_ad9361/dac_enable_i1] [get_bd_pins ad9361_dac_unpacker/enable_2]
connect_bd_net -net axi_ad9361_0_dac_enable_q0 [get_bd_pins axi_ad9361/dac_enable_q0] [get_bd_pins ad9361_dac_unpacker/enable_1]
connect_bd_net -net axi_ad9361_0_dac_enable_q1 [get_bd_pins axi_ad9361/dac_enable_q1] [get_bd_pins ad9361_dac_unpacker/enable_3]
connect_bd_net -net axi_ad9361_0_dac_valid_i0 [get_bd_pins axi_ad9361/dac_valid_i0] [get_bd_pins logic_or_1/Op1]
connect_bd_net -net axi_ad9361_0_dac_valid_i1 [get_bd_pins axi_ad9361/dac_valid_i1] [get_bd_pins logic_or_1/Op2]
connect_bd_net -net axi_ad9361_0_enable [get_bd_pins axi_ad9361/enable] [get_bd_ports TRX_EN]
connect_bd_net -net axi_ad9361_0_gps_pps_irq [get_bd_pins axi_ad9361/gps_pps_irq] [get_bd_pins irq_concat_0/In15]
connect_bd_net -net axi_ad9361_0_l_clk [get_bd_pins axi_ad9361/l_clk] \
  [get_bd_pins ad9361_dac_unpacker/clk] [get_bd_pins axi_ad9361/clk] [get_bd_pins ad9361_adc_packer/clk] \
  [get_bd_pins rst_axi_ad9361_61M44/slowest_sync_clk] [get_bd_pins axi_peripheral_interconnect/M16_ACLK] \
  [get_bd_pins axi_dmac_rf_rx/fifo_wr_clk] [get_bd_pins axi_dmac_rf_tx/m_axis_aclk] [get_bd_pins axi_rf_timestamping_0/aclk]
connect_bd_net -net axi_ad9361_0_rst [get_bd_pins axi_ad9361/rst] [get_bd_pins rst_axi_ad9361_61M44/aux_reset_in]
connect_bd_net -net axi_ad9361_0_tx_clk_out [get_bd_pins axi_ad9361/tx_clk_out] [get_bd_ports TRX_FBCLK]
connect_bd_net -net axi_ad9361_0_tx_data_out [get_bd_pins axi_ad9361/tx_data_out] [get_bd_ports TRX_P0_TXDATA]
connect_bd_net -net axi_ad9361_0_tx_frame_out [get_bd_pins axi_ad9361/tx_frame_out] [get_bd_ports TRX_TXFRAME]
connect_bd_net -net axi_ad9361_0_txnrx [get_bd_pins axi_ad9361/txnrx] [get_bd_ports TRX_TXNRX]
connect_bd_net [get_bd_pins axi_ad9361/adc_r1_mode] [get_bd_pins gpio_concat_0_2/In0]
connect_bd_net [get_bd_pins axi_ad9361/dac_r1_mode] [get_bd_pins gpio_concat_0_2/In1]
connect_bd_net [get_bd_pins axi_dmac_i2s_rx/irq] [get_bd_pins irq_concat_0/In6]
connect_bd_net [get_bd_pins axi_dmac_i2s_tx/irq] [get_bd_pins irq_concat_0/In7]
connect_bd_net [get_bd_pins axi_dmac_rf_rx/fifo_wr_xfer_req] [get_bd_pins logic_not_1/Op1] [get_bd_pins axi_rf_timestamping_0/rx_dma_xfer_req]
connect_bd_net [get_bd_pins axi_dmac_rf_rx/irq] [get_bd_pins irq_concat_0/In0]
connect_bd_net [get_bd_pins axi_dmac_rf_tx/irq] [get_bd_pins irq_concat_0/In1]
connect_bd_net [get_bd_pins axi_dmac_rf_tx/m_axis_data] [get_bd_pins ad9361_dac_unpacker/s_axis_data]
connect_bd_net [get_bd_pins axi_dmac_rf_tx/m_axis_valid] [get_bd_pins logic_and_2/Op2] [get_bd_pins axi_rf_timestamping_0/tx_dma_data_ready]
connect_bd_net [get_bd_pins axi_dmac_rf_tx/m_axis_xfer_req] [get_bd_pins logic_not_0/Op1]
connect_bd_net [get_bd_pins axi_dna_0/dna_ready] [get_bd_pins irq_concat_0/In18]
connect_bd_net -net axi_gpio_0_gpio_io_o [get_bd_pins axi_gpio_0/gpio_o] \
  [get_bd_pins gpio_slice_trx_ctrl_out/Din] [get_bd_pins gpio_slice_trx_sync_in/Din] [get_bd_pins gpio_slice_trx_en_agc/Din] \
  [get_bd_pins gpio_slice_trx_up_enable/Din] [get_bd_pins gpio_slice_trx_up_txnrx/Din] \
  [get_bd_pins gpio_slice_trx_resetn/Din]
connect_bd_net -net axi_gpio_1_gpio_io_o [get_bd_pins axi_gpio_1/gpio_o] \
  [get_bd_pins gpio_slice_synth_sync/Din] [get_bd_pins gpio_slice_synth_mute/Din] [get_bd_pins gpio_slice_synth_ce/Din] \
  [get_bd_pins gpio_slice_synth_resetn/Din]
connect_bd_net -net axi_gpio_2_gpio_io_o [get_bd_pins axi_gpio_2/gpio_o] \
  [get_bd_pins gpio_slice_sys_aux_reset/Din] [get_bd_pins gpio_slice_cpu_resetn/Din] [get_bd_pins gpio_slice_cm4_wake/Din] \
  [get_bd_pins gpio_slice_ddr_reset/Din] [get_bd_pins gpio_slice_ddr_intf_reset/Din] [get_bd_pins gpio_slice_i2s_reset/Din] \
  [get_bd_pins gpio_slice_pm_i2c_en/Din] [get_bd_pins gpio_slice_clk_mngr_oen/Din] [get_bd_pins gpio_slice_codec_resetn/Din]
connect_bd_net [get_bd_pins axi_i2s_0/i2s_bclk] [get_bd_ports CODEC_I2S_BCLK]
connect_bd_net [get_bd_pins axi_i2s_0/i2s_lrclk] [get_bd_ports CODEC_I2S_LRCLK]
connect_bd_net [get_bd_pins axi_i2s_0/i2s_mclk] [get_bd_ports CODEC_MCLK]
connect_bd_net [get_bd_pins axi_i2s_0/i2s_sdata_out] [get_bd_ports CODEC_I2S_SDIN]
connect_bd_net [get_bd_pins axi_iic_0/iic2intc_irpt] [get_bd_pins irq_concat_0/In3]
connect_bd_net [get_bd_pins axi_iic_1/iic2intc_irpt] [get_bd_pins irq_concat_0/In11]
connect_bd_net [get_bd_pins axi_iic_2/iic2intc_irpt] [get_bd_pins irq_concat_0/In19]
connect_bd_net [get_bd_pins axi_irq_controller_0/cpu_irq_out] [get_bd_pins picorv32_0/irq]
connect_bd_net [get_bd_pins axi_irq_controller_0/pcie_msi_request] [get_bd_pins axi_pcie_0/INTX_MSI_Request]
connect_bd_net [get_bd_pins axi_irq_controller_0/pcie_msi_vector] [get_bd_pins axi_pcie_0/MSI_Vector_Num]
connect_bd_net [get_bd_pins axi_pcie_0/INTX_MSI_Grant] [get_bd_pins axi_irq_controller_0/pcie_msi_granted]
connect_bd_net [get_bd_pins axi_pcie_0/MSI_Vector_Width] [get_bd_pins axi_irq_controller_0/pcie_msi_vector_width]
connect_bd_net [get_bd_pins axi_pcie_0/MSI_enable] [get_bd_pins axi_irq_controller_0/pcie_msi_enabled]
connect_bd_net [get_bd_pins axi_pcie_0/axi_aclk_out] \
  [get_bd_pins rst_axi_pcie_0_125M/slowest_sync_clk] [get_bd_pins xadc_wiz_0/s_axi_aclk] [get_bd_pins axi_ad9361/s_axi_aclk] \
  [get_bd_pins axi_bram_ctrl_0/s_axi_aclk] [get_bd_pins axi_iic_0/s_axi_aclk] [get_bd_pins axi_protocol_convert_0/aclk] \
  [get_bd_pins picorv32_0/clk] [get_bd_pins axi_iic_1/s_axi_aclk] \
  [get_bd_pins rst_axi_pcie_0_125M_pcie_core/slowest_sync_clk] [get_bd_pins rst_pulse_gen_0/clk] \
  [get_bd_pins axi_peripheral_interconnect/M06_ACLK] [get_bd_pins axi_peripheral_interconnect/M07_ACLK] \
  [get_bd_pins axi_peripheral_interconnect/M09_ACLK] [get_bd_pins axi_peripheral_interconnect/M10_ACLK] \
  [get_bd_pins axi_peripheral_interconnect/M11_ACLK] [get_bd_pins axi_peripheral_interconnect/M12_ACLK] \
  [get_bd_pins axi_peripheral_interconnect/M13_ACLK] [get_bd_pins axi_peripheral_interconnect/M14_ACLK] \
  [get_bd_pins axi_peripheral_interconnect/M15_ACLK] [get_bd_pins axi_peripheral_interconnect/ACLK] \
  [get_bd_pins axi_peripheral_interconnect/M04_ACLK] [get_bd_pins axi_peripheral_interconnect/M03_ACLK] \
  [get_bd_pins axi_peripheral_interconnect/M02_ACLK] [get_bd_pins axi_peripheral_interconnect/M01_ACLK] \
  [get_bd_pins axi_peripheral_interconnect/M00_ACLK] [get_bd_pins axi_peripheral_interconnect/S00_ACLK] \
  [get_bd_pins axi_cpu_dma_interconnect/S04_ACLK] [get_bd_pins axi_cpu_dma_interconnect/ACLK] \
  [get_bd_pins axi_cpu_dma_interconnect/S00_ACLK] [get_bd_pins axi_cpu_dma_interconnect/M00_ACLK] \
  [get_bd_pins axi_cpu_dma_interconnect/M01_ACLK] [get_bd_pins axi_cpu_dma_interconnect/S01_ACLK] \
  [get_bd_pins axi_cpu_dma_interconnect/S02_ACLK] [get_bd_pins axi_cpu_dma_interconnect/S03_ACLK] \
  [get_bd_pins axi_peripheral_interconnect/M17_ACLK] [get_bd_pins axi_peripheral_interconnect/M18_ACLK] \
  [get_bd_pins axi_dmac_i2s_rx/s_axi_aclk] [get_bd_pins axi_dmac_i2s_rx/m_dest_axi_aclk] \
  [get_bd_pins axi_dmac_rf_rx/s_axi_aclk] [get_bd_pins axi_dmac_rf_rx/m_dest_axi_aclk] \
  [get_bd_pins axi_dmac_i2s_tx/s_axi_aclk] [get_bd_pins axi_dmac_i2s_tx/m_src_axi_aclk] \
  [get_bd_pins axi_dmac_rf_tx/s_axi_aclk] [get_bd_pins axi_dmac_rf_tx/m_src_axi_aclk] [get_bd_pins axi_iic_2/s_axi_aclk] \
  [get_bd_pins axi_peripheral_interconnect/M19_ACLK] [get_bd_pins axi_dna_0/aclk] [get_bd_pins axi_irq_controller_0/aclk] \
  [get_bd_pins axi_gpio_0/aclk] [get_bd_pins axi_gpio_1/aclk] [get_bd_pins axi_gpio_2/aclk] \
  [get_bd_pins axi_pcie_interconnect/ACLK] [get_bd_pins axi_pcie_interconnect/S00_ACLK] \
  [get_bd_pins axi_pcie_interconnect/M00_ACLK] [get_bd_pins axi_pcie_interconnect/M01_ACLK] \
  [get_bd_pins axi_pcie_interconnect/S01_ACLK] [get_bd_pins axi_pcie_interconnect/M03_ACLK] [get_bd_pins axi_qspi_mm_0/aclk] \
  [get_bd_pins axi_spi_1/aclk] [get_bd_pins axi_spi_0/aclk]
connect_bd_net [get_bd_pins axi_pcie_0/axi_ctl_aclk_out] [get_bd_pins axi_peripheral_interconnect/M05_ACLK]
connect_bd_net [get_bd_pins axi_pcie_0/interrupt_out] [get_bd_pins irq_concat_0/In5]
connect_bd_net [get_bd_pins axi_pcie_0/mmcm_lock] \
  [get_bd_pins rst_axi_pcie_0_125M/dcm_locked] [get_bd_pins gpio_concat_2/In2] \
  [get_bd_pins rst_axi_pcie_0_125M_pcie_core/dcm_locked]
connect_bd_net [get_bd_pins axi_pcie_0/user_link_up] [get_bd_pins gpio_concat_2/In5] [get_bd_pins user_led_0/user_led]
connect_bd_net [get_bd_pins axi_rf_timestamping_0/rx_enable] [get_bd_pins logic_and_0/Op1]
connect_bd_net [get_bd_pins axi_rf_timestamping_0/tx_enable] [get_bd_pins logic_and_2/Op1]
connect_bd_net [get_bd_pins clk_wiz_0/clk_out1] [get_bd_pins mig_7series_0/sys_clk_i] [get_bd_pins rst_clk_wiz_0_250M/slowest_sync_clk]
connect_bd_net -net clk_wiz_0_delay_ref_clk [get_bd_pins clk_wiz_0/clk_out2] [get_bd_pins axi_ad9361/delay_clk] [get_bd_pins mig_7series_0/clk_ref_i]
connect_bd_net [get_bd_pins clk_wiz_0/locked] [get_bd_pins rst_clk_wiz_0_250M/dcm_locked] [get_bd_pins gpio_concat_2/In0]
connect_bd_net [get_bd_pins gpio_concat_0_2/dout] [get_bd_pins gpio_concat_0/In4]
connect_bd_net [get_bd_pins gpio_concat_0/dout] [get_bd_pins axi_gpio_0/gpio_i]
connect_bd_net -net gpio_concat_1_dout [get_bd_pins gpio_concat_0_1/dout] [get_bd_pins gpio_concat_0/In2]
connect_bd_net -net gpio_concat_2_dout [get_bd_pins gpio_concat_1/dout] [get_bd_pins axi_gpio_1/gpio_i]
connect_bd_net [get_bd_pins gpio_concat_2/dout] [get_bd_pins axi_gpio_2/gpio_i]
connect_bd_net [get_bd_pins gpio_slice_clk_mngr_oen/Dout] [get_bd_ports CLK_MNGR_OEn]
connect_bd_net [get_bd_pins gpio_slice_cm4_wake/Dout] [get_bd_ports CM4_WAKE]
connect_bd_net [get_bd_pins gpio_slice_codec_resetn/Dout] [get_bd_ports CODEC_RSTn]
connect_bd_net [get_bd_pins gpio_slice_cpu_resetn/Dout] [get_bd_pins picorv32_0/resetn]
connect_bd_net [get_bd_pins gpio_slice_ddr_intf_reset/Dout] [get_bd_pins logic_or_2/Op2]
connect_bd_net [get_bd_pins gpio_slice_ddr_reset/Dout] [get_bd_pins rst_clk_wiz_0_250M/aux_reset_in]
connect_bd_net [get_bd_pins gpio_slice_i2s_reset/Dout] [get_bd_pins rst_FPGA_CLK1_49M152/aux_reset_in]
connect_bd_net [get_bd_pins gpio_slice_pm_i2c_en/Dout] [get_bd_ports PM_I2C_EN]
connect_bd_net [get_bd_pins gpio_slice_synth_ce/Dout] [get_bd_ports SYNTH_CE]
connect_bd_net [get_bd_pins gpio_slice_synth_mute/Dout] [get_bd_ports SYNTH_MUTE]
connect_bd_net [get_bd_pins gpio_slice_synth_resetn/Dout] [get_bd_ports SYNTH_RESETn]
connect_bd_net [get_bd_pins gpio_slice_synth_sync/Dout] [get_bd_ports SYNTH_SYNC]
connect_bd_net [get_bd_pins gpio_slice_sys_aux_reset/Dout] [get_bd_pins rst_pulse_gen_0/trigger]
connect_bd_net [get_bd_pins gpio_slice_trx_en_agc/Dout] [get_bd_ports TRX_EN_AGC]
connect_bd_net -net gpio_slice_trx_resestn_Dout [get_bd_pins gpio_slice_trx_resetn/Dout] [get_bd_ports TRX_RESETn]
connect_bd_net [get_bd_pins gpio_slice_trx_sync_in/Dout] [get_bd_ports TRX_SYNC_IN]
connect_bd_net [get_bd_pins gpio_slice_trx_up_enable/Dout] [get_bd_pins axi_ad9361/up_enable]
connect_bd_net [get_bd_pins gpio_slice_trx_up_txnrx/Dout] [get_bd_pins axi_ad9361/up_txnrx]
connect_bd_net -net i2s_sdata_in_0_1 [get_bd_ports CODEC_I2S_SDOUT] [get_bd_pins axi_i2s_0/i2s_sdata_in]
connect_bd_net [get_bd_pins irq_concat_0/dout] [get_bd_pins axi_irq_controller_0/irq_in]
connect_bd_net [get_bd_pins logic_and_0/Res] [get_bd_pins ad9361_adc_packer/fifo_wr_en]
connect_bd_net [get_bd_pins logic_and_2/Res] [get_bd_pins ad9361_dac_unpacker/s_axis_valid]
connect_bd_net [get_bd_pins logic_not_0/Res] [get_bd_pins logic_or_3/Op1]
connect_bd_net [get_bd_pins logic_not_1/Res] [get_bd_pins logic_or_4/Op1]
connect_bd_net [get_bd_pins logic_or_0/Res] [get_bd_pins logic_and_0/Op2] [get_bd_pins axi_rf_timestamping_0/rx_data_ready]
connect_bd_net [get_bd_pins logic_or_1/Res] [get_bd_pins ad9361_dac_unpacker/fifo_rd_en] [get_bd_pins axi_rf_timestamping_0/tx_data_ready]
connect_bd_net [get_bd_pins logic_or_2/Res] [get_bd_pins rst_mig_7series_0_166M/aux_reset_in]
connect_bd_net [get_bd_pins logic_or_3/Res] [get_bd_pins ad9361_dac_unpacker/reset]
connect_bd_net [get_bd_pins logic_or_4/Res] [get_bd_pins ad9361_adc_packer/reset]
connect_bd_net [get_bd_pins mig_7series_0/init_calib_complete] [get_bd_pins gpio_concat_2/In4]
connect_bd_net [get_bd_pins mig_7series_0/mmcm_locked] [get_bd_pins rst_mig_7series_0_166M/dcm_locked] [get_bd_pins gpio_concat_2/In1]
connect_bd_net [get_bd_pins mig_7series_0/ui_clk] [get_bd_pins rst_mig_7series_0_166M/slowest_sync_clk] [get_bd_pins axi_pcie_interconnect/M02_ACLK]
connect_bd_net [get_bd_pins mig_7series_0/ui_clk_sync_rst] [get_bd_pins logic_or_2/Op1]
connect_bd_net [get_bd_pins picorv32_0/eoi] [get_bd_pins axi_irq_controller_0/cpu_eoi_in]
connect_bd_net [get_bd_pins picorv32_0/trap] [get_bd_pins gpio_concat_2/In6]
connect_bd_net [get_bd_pins rst_FPGA_CLK1_49M152/interconnect_aresetn] [get_bd_pins axi_peripheral_interconnect/M08_ARESETN]
connect_bd_net [get_bd_pins rst_FPGA_CLK1_49M152/peripheral_aresetn] [get_bd_pins gpio_concat_2/In12] [get_bd_pins axi_i2s_0/aresetn]
connect_bd_net [get_bd_pins rst_axi_ad9361_61M44/peripheral_aresetn] [get_bd_pins gpio_concat_0/In6] [get_bd_pins axi_rf_timestamping_0/aresetn]
connect_bd_net [get_bd_pins rst_axi_ad9361_61M44/peripheral_reset] [get_bd_pins logic_or_3/Op2] [get_bd_pins logic_or_4/Op2]
